# Altium project RK3328.PrjPcb (part 1 of 3)
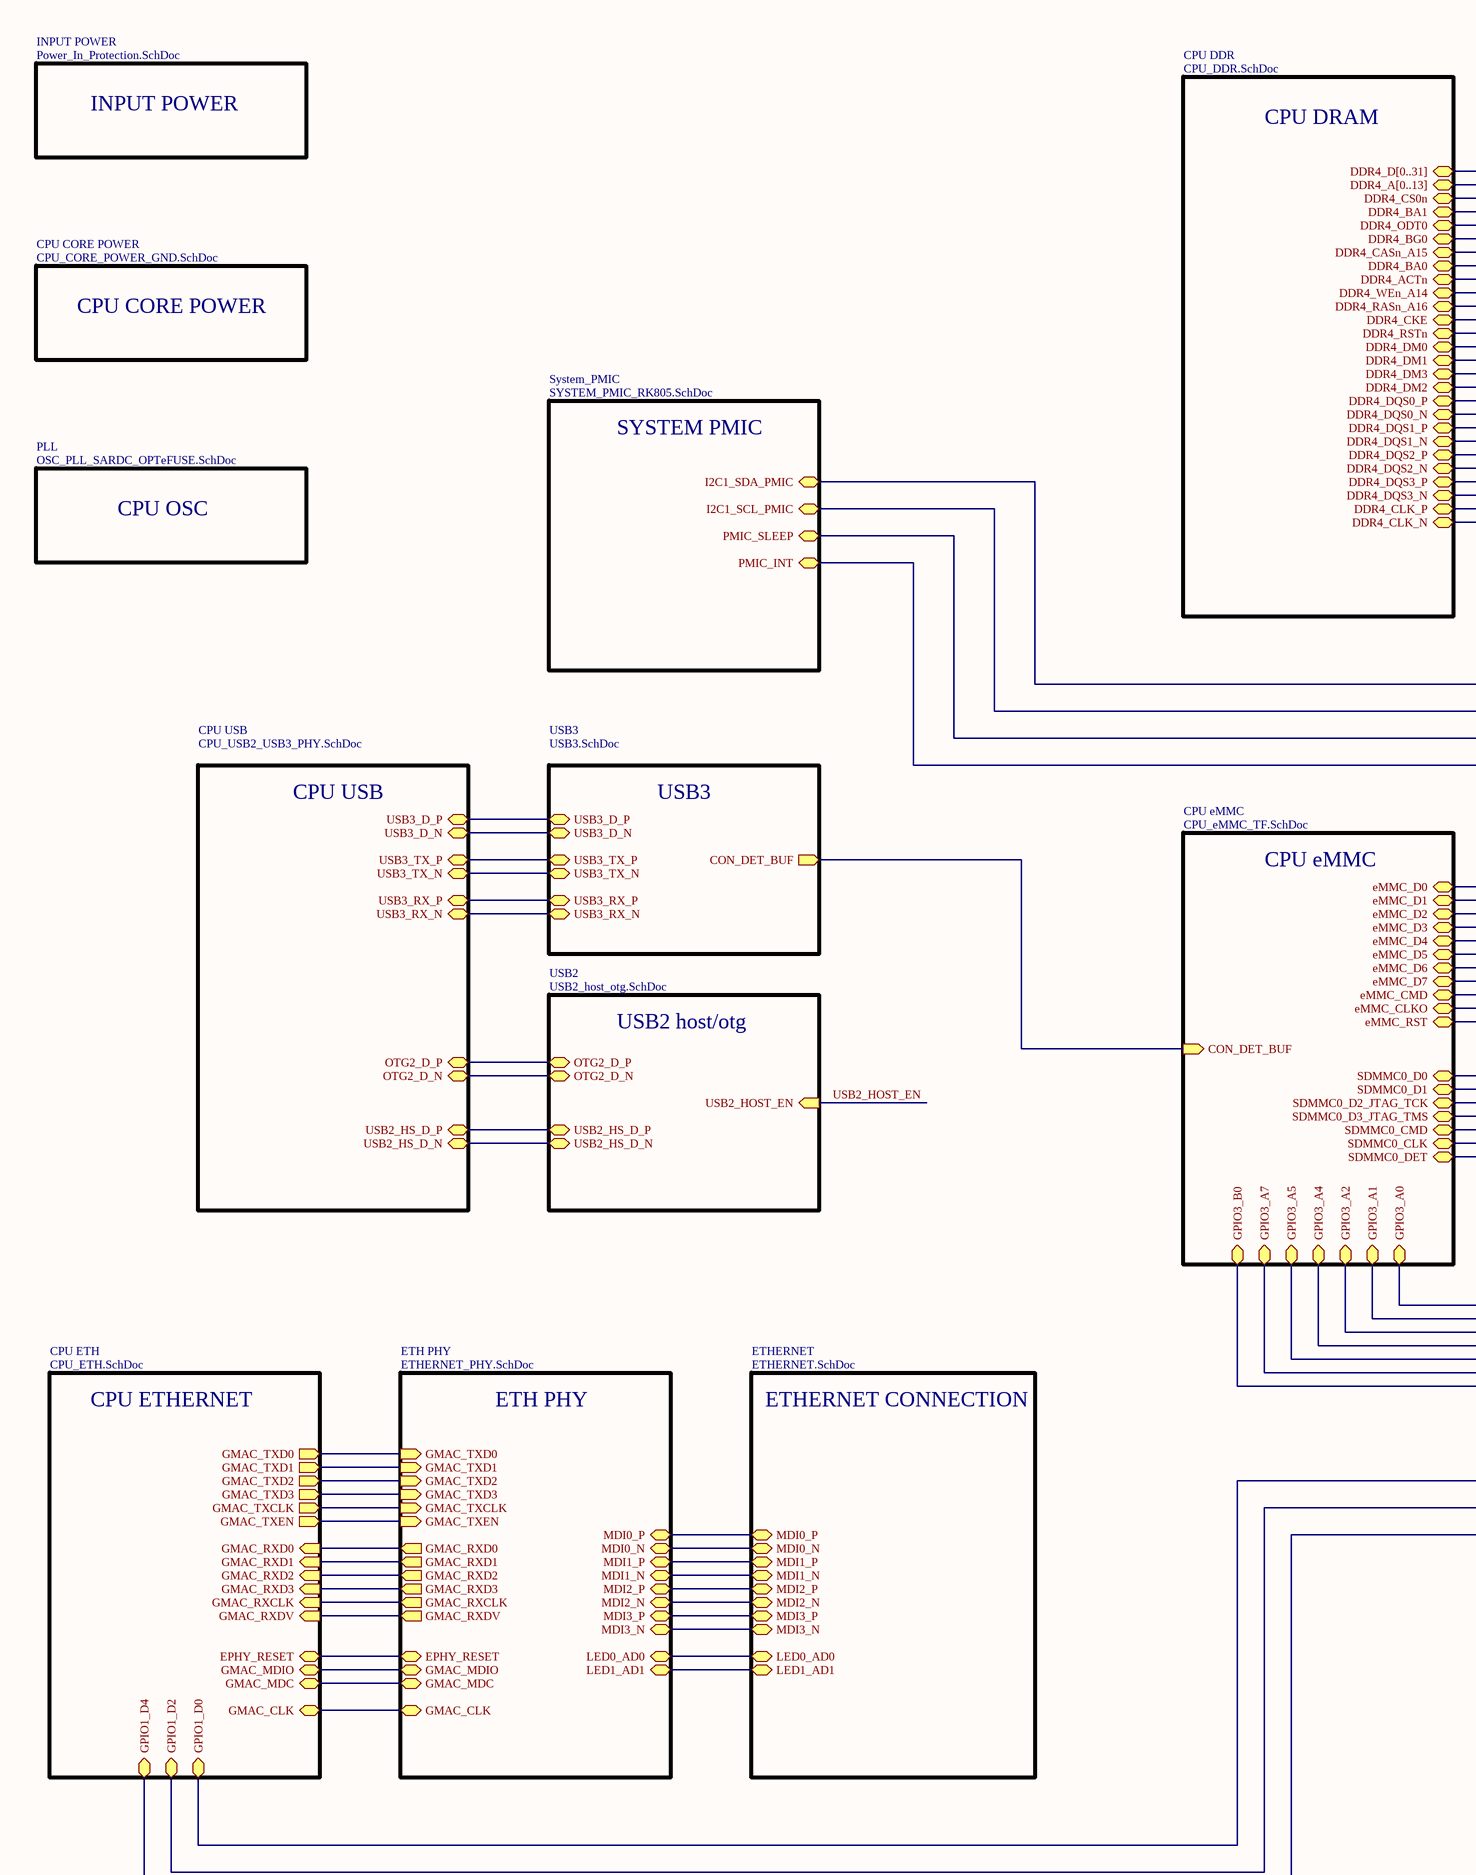
[diagram p0: BLOCKS.SchDoc, left]
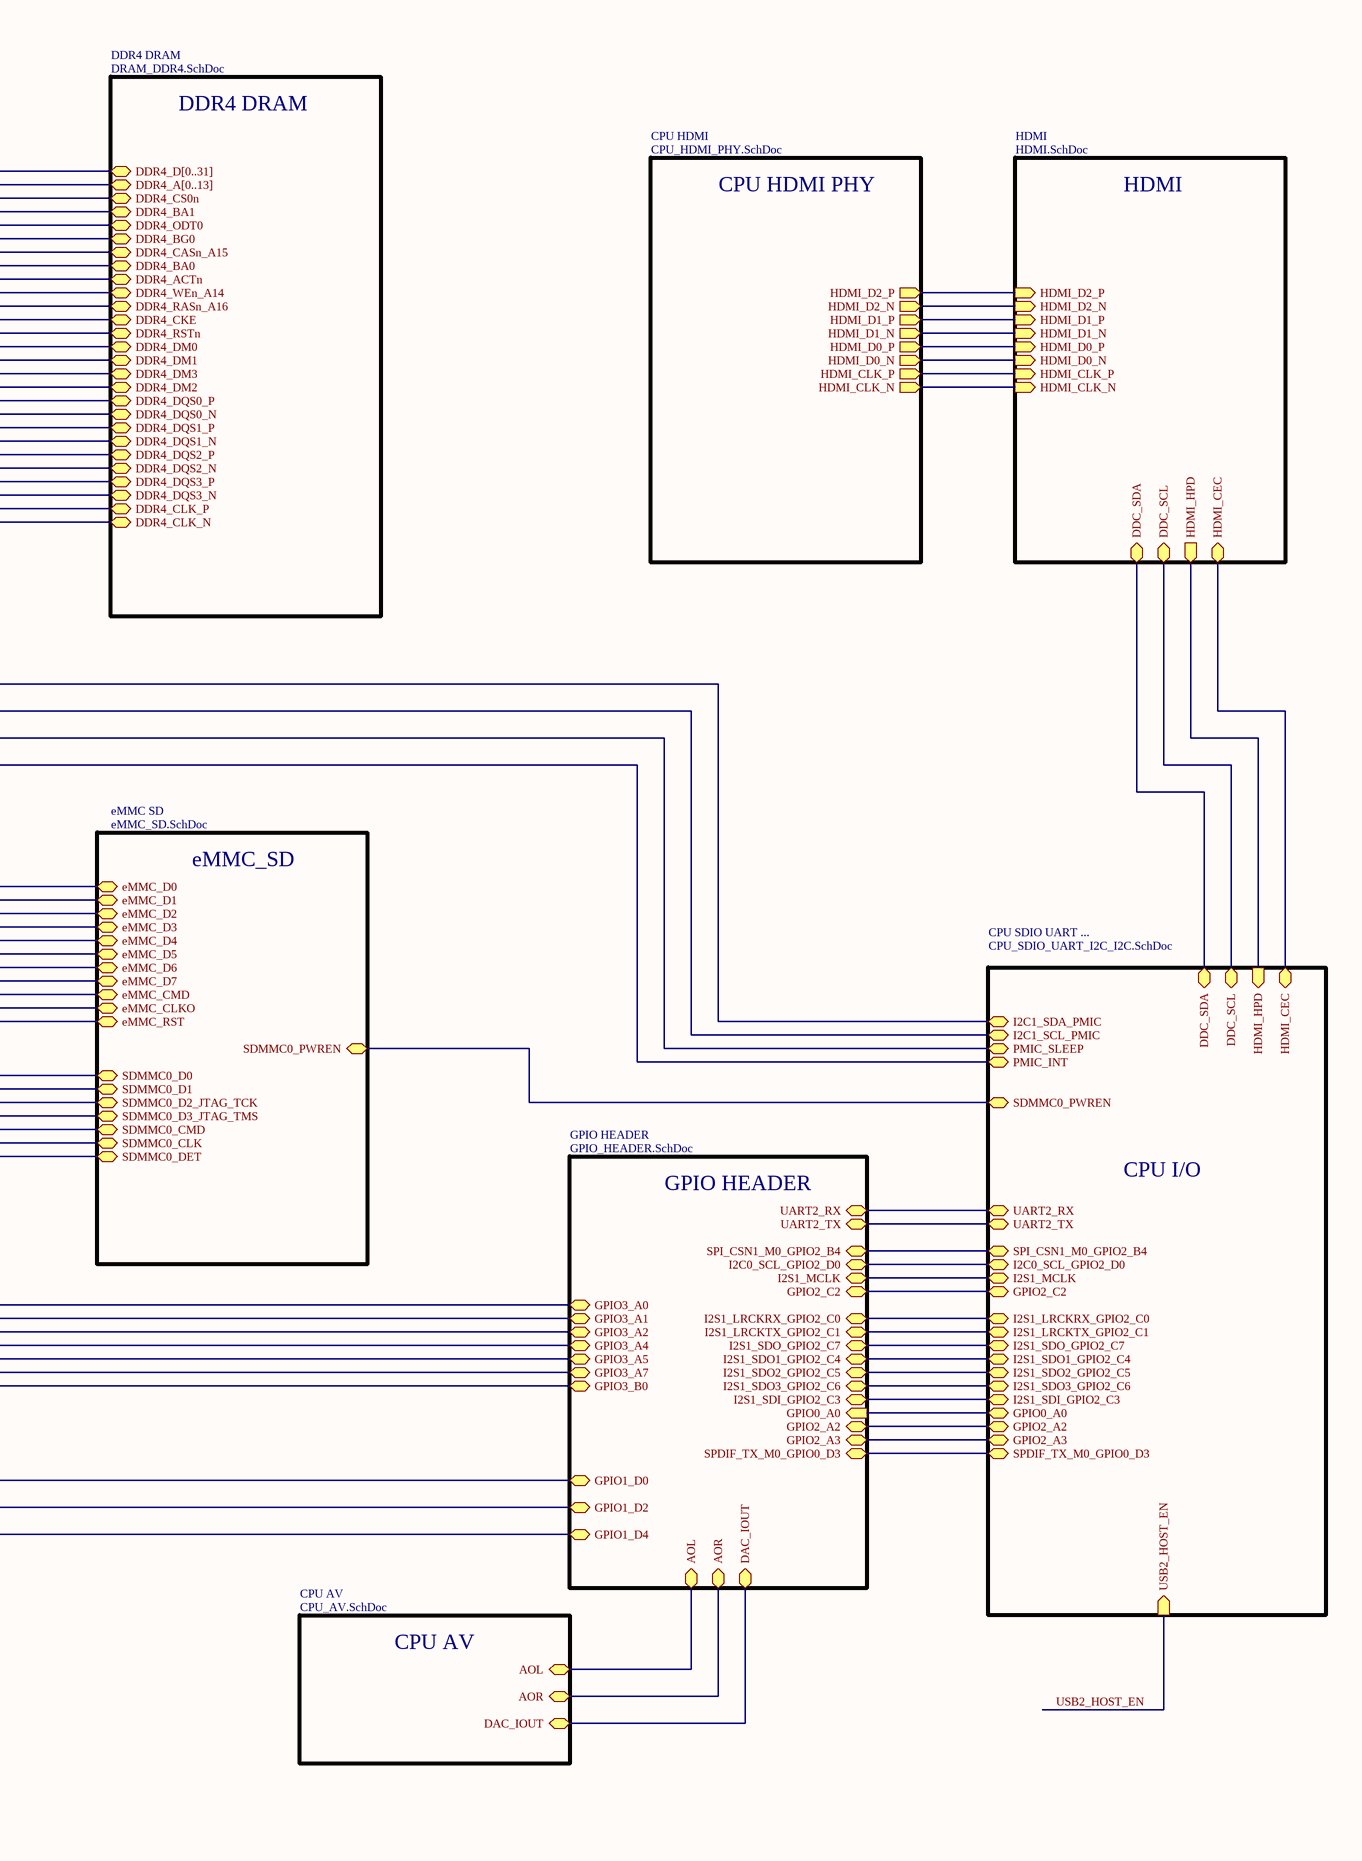
[diagram p1: BLOCKS.SchDoc, right]
21 sheets, 373 parts. Net scope: hierarchical (ports join the sheet entries above them; power ports are global).
Board file: RK3328.PcbDoc
Sheets:
  Cover.SchDoc
  BLOCKS.SchDoc
    System_PMIC = SYSTEM_PMIC_RK805.SchDoc
    CPU CORE POWER = CPU_CORE_POWER_GND.SchDoc
    CPU DDR = CPU_DDR.SchDoc
    DDR4 DRAM = DRAM_DDR4.SchDoc
    CPU eMMC = CPU_eMMC_TF.SchDoc
    eMMC SD = eMMC_SD.SchDoc
    PLL = OSC_PLL_SARDC_OPTeFUSE.SchDoc
    CPU USB = CPU_USB2_USB3_PHY.SchDoc
    USB3 = USB3.SchDoc
    USB2 = USB2_host_otg.SchDoc
    CPU HDMI = CPU_HDMI_PHY.SchDoc
    HDMI = HDMI.SchDoc
    CPU ETH = CPU_ETH.SchDoc
    ETH PHY = ETHERNET_PHY.SchDoc
    ETHERNET = ETHERNET.SchDoc
    GPIO HEADER = GPIO_HEADER.SchDoc
    CPU SDIO UART ... = CPU_SDIO_UART_I2C_I2C.SchDoc
    CPU AV = CPU_AV.SchDoc
    INPUT POWER = Power_In_Protection.SchDoc

## Sheet Cover.SchDoc
size A3; SheetNumber: 1; SheetTotal: 21

## Sheet BLOCKS.SchDoc
size A2; SheetNumber: 2; SheetTotal: 21

### Sub-sheets
CPU AV = CPU_AV.SchDoc: AOL (bidir), AOR (bidir), DAC_IOUT (bidir)
CPU CORE POWER = CPU_CORE_POWER_GND.SchDoc: no entries
CPU DDR = CPU_DDR.SchDoc: DDR4_D[0..31] (bidir), DDR4_A[0..13] (bidir), DDR4_CS0n (bidir), DDR4_BA1 (bidir), DDR4_ODT0 (bidir), DDR4_BG0 (bidir), DDR4_CASn_A15 (bidir), DDR4_BA0 (bidir), DDR4_ACTn (bidir), DDR4_WEn_A14 (bidir), DDR4_RASn_A16 (bidir), DDR4_CKE (bidir), DDR4_RSTn (bidir), DDR4_DM0 (bidir), DDR4_DM1 (bidir), DDR4_DM3 (bidir), DDR4_DM2 (bidir), DDR4_DQS0_P (bidir), DDR4_DQS0_N (bidir), DDR4_DQS1_P (bidir), DDR4_DQS1_N (bidir), DDR4_DQS2_P (bidir), DDR4_DQS2_N (bidir), DDR4_DQS3_P (bidir), DDR4_DQS3_N (bidir), DDR4_CLK_P (bidir), DDR4_CLK_N (bidir)
CPU eMMC = CPU_eMMC_TF.SchDoc: GPIO3_A4 (bidir), GPIO3_A5 (bidir), GPIO3_A7 (bidir), GPIO3_A0 (bidir), GPIO3_A2 (bidir), GPIO3_A1 (bidir), GPIO3_B0 (bidir), CON_DET_BUF (in), eMMC_D0 (bidir), eMMC_D1 (bidir), eMMC_D2 (bidir), eMMC_D3 (bidir), eMMC_D4 (bidir), eMMC_D5 (bidir), eMMC_D6 (bidir), eMMC_D7 (bidir), eMMC_CMD (bidir), eMMC_CLKO (bidir), eMMC_RST (bidir), SDMMC0_D0 (bidir), SDMMC0_D1 (bidir), SDMMC0_D2_JTAG_TCK (bidir), SDMMC0_D3_JTAG_TMS (bidir), SDMMC0_CMD (bidir), SDMMC0_CLK (bidir), SDMMC0_DET (bidir)
CPU ETH = CPU_ETH.SchDoc: GMAC_TXD1 (out), GMAC_TXD0 (out), GMAC_TXCLK (out), GMAC_TXD2 (out), GMAC_TXD3 (out), GMAC_TXEN (out), GMAC_RXD1 (in), GMAC_RXD0 (in), GMAC_RXD2 (in), GMAC_RXD3 (in), GMAC_RXCLK (in), GMAC_RXDV (in), GMAC_CLK (bidir), EPHY_RESET (bidir), GMAC_MDIO (bidir), GMAC_MDC (bidir), GPIO1_D2 (bidir), GPIO1_D4 (bidir), GPIO1_D0 (bidir)
CPU HDMI = CPU_HDMI_PHY.SchDoc: HDMI_D2_P (out), HDMI_D2_N (out), HDMI_D1_P (out), HDMI_D1_N (out), HDMI_D0_P (out), HDMI_D0_N (out), HDMI_CLK_P (out), HDMI_CLK_N (out)
CPU SDIO UART ... = CPU_SDIO_UART_I2C_I2C.SchDoc: HDMI_HPD (in), HDMI_CEC (bidir), DDC_SDA (bidir), I2C1_SDA_PMIC (bidir), I2C1_SCL_PMIC (bidir), PMIC_SLEEP (bidir), PMIC_INT (bidir), UART2_RX (bidir), UART2_TX (bidir), SPI_CSN1_M0_GPIO2_B4 (bidir), GPIO2_A3 (bidir), I2C0_SCL_GPIO2_D0 (bidir), I2S1_MCLK (bidir), GPIO2_C2 (bidir), I2S1_LRCKTX_GPIO2_C1 (bidir), I2S1_LRCKRX_GPIO2_C0 (bidir), I2S1_SDO_GPIO2_C7 (bidir), I2S1_SDO1_GPIO2_C4 (bidir), I2S1_SDO2_GPIO2_C5 (bidir), I2S1_SDO3_GPIO2_C6 (bidir), I2S1_SDI_GPIO2_C3 (bidir), USB2_HOST_EN (in), GPIO2_A2 (bidir), SPDIF_TX_M0_GPIO0_D3 (bidir), SDMMC0_PWREN (bidir), DDC_SCL (bidir), GPIO0_A0 (bidir)
CPU USB = CPU_USB2_USB3_PHY.SchDoc: USB3_D_P (bidir), USB3_D_N (bidir), USB3_RX_P (bidir), USB3_RX_N (bidir), USB3_TX_P (bidir), USB3_TX_N (bidir), OTG2_D_N (bidir), OTG2_D_P (bidir), USB2_HS_D_N (bidir), USB2_HS_D_P (bidir)
DDR4 DRAM = DRAM_DDR4.SchDoc: DDR4_D[0..31] (bidir), DDR4_A[0..13] (bidir), DDR4_CS0n (bidir), DDR4_BA1 (bidir), DDR4_ODT0 (bidir), DDR4_BG0 (bidir), DDR4_CASn_A15 (bidir), DDR4_BA0 (bidir), DDR4_ACTn (bidir), DDR4_WEn_A14 (bidir), DDR4_RASn_A16 (bidir), DDR4_CKE (bidir), DDR4_RSTn (bidir), DDR4_DM0 (bidir), DDR4_DM1 (bidir), DDR4_DM3 (bidir), DDR4_DM2 (bidir), DDR4_DQS0_P (bidir), DDR4_DQS0_N (bidir), DDR4_DQS1_P (bidir), DDR4_DQS1_N (bidir), DDR4_DQS2_P (bidir), DDR4_DQS2_N (bidir), DDR4_DQS3_P (bidir), DDR4_DQS3_N (bidir), DDR4_CLK_P (bidir), DDR4_CLK_N (bidir)
eMMC SD = eMMC_SD.SchDoc: eMMC_D1 (bidir), eMMC_D2 (bidir), eMMC_D3 (bidir), eMMC_D4 (bidir), eMMC_D5 (bidir), eMMC_D6 (bidir), eMMC_D7 (bidir), eMMC_D0 (bidir), eMMC_CLKO (bidir), eMMC_CMD (bidir), eMMC_RST (bidir), SDMMC0_PWREN (bidir), SDMMC0_D0 (bidir), SDMMC0_D1 (bidir), SDMMC0_D2_JTAG_TCK (bidir), SDMMC0_D3_JTAG_TMS (bidir), SDMMC0_CMD (bidir), SDMMC0_CLK (bidir), SDMMC0_DET (bidir)
ETH PHY = ETHERNET_PHY.SchDoc: GMAC_MDIO (bidir), GMAC_MDC (bidir), GMAC_RXD0 (out), GMAC_RXD1 (out), GMAC_RXD2 (out), GMAC_RXD3 (out), GMAC_RXCLK (out), GMAC_RXDV (out), GMAC_TXD0 (in), GMAC_TXD1 (in), GMAC_TXD2 (in), GMAC_TXD3 (in), GMAC_TXEN (in), GMAC_TXCLK (in), GMAC_CLK (bidir), EPHY_RESET (bidir), MDI0_P (bidir), MDI0_N (bidir), MDI1_P (bidir), MDI1_N (bidir), MDI2_P (bidir), MDI2_N (bidir), MDI3_P (bidir), MDI3_N (bidir), LED0_AD0 (bidir), LED1_AD1 (bidir)
ETHERNET = ETHERNET.SchDoc: MDI0_P (bidir), MDI0_N (bidir), MDI1_P (bidir), MDI1_N (bidir), MDI2_P (bidir), MDI2_N (bidir), MDI3_P (bidir), MDI3_N (bidir), LED0_AD0 (bidir), LED1_AD1 (bidir)
GPIO HEADER = GPIO_HEADER.SchDoc: AOL (bidir), AOR (bidir), GPIO3_A4 (bidir), GPIO3_A5 (bidir), GPIO3_A0 (bidir), GPIO3_A2 (bidir), GPIO3_A1 (bidir), GPIO3_B0 (bidir), GPIO1_D2 (bidir), GPIO3_A7 (bidir), GPIO1_D4 (bidir), DAC_IOUT (bidir), GPIO1_D0 (bidir), UART2_RX (bidir), UART2_TX (bidir), SPI_CSN1_M0_GPIO2_B4 (bidir), I2S1_LRCKRX_GPIO2_C0 (bidir), I2S1_SDO_GPIO2_C7 (bidir), I2S1_SDO1_GPIO2_C4 (bidir), I2S1_SDO2_GPIO2_C5 (bidir), I2S1_SDI_GPIO2_C3 (bidir), GPIO0_A0 (in), I2S1_MCLK (bidir), GPIO2_A2 (bidir), GPIO2_C2 (bidir), SPDIF_TX_M0_GPIO0_D3 (bidir), GPIO2_A3 (bidir), I2S1_LRCKTX_GPIO2_C1 (bidir), I2S1_SDO3_GPIO2_C6 (bidir), I2C0_SCL_GPIO2_D0 (bidir)
HDMI = HDMI.SchDoc: HDMI_D2_P (in), HDMI_D2_N (in), HDMI_D1_P (in), HDMI_D1_N (in), HDMI_D0_P (in), HDMI_D0_N (in), HDMI_CLK_P (in), HDMI_CLK_N (in), HDMI_CEC (bidir), DDC_SDA (bidir), HDMI_HPD (out), DDC_SCL (bidir)
INPUT POWER = Power_In_Protection.SchDoc: no entries
PLL = OSC_PLL_SARDC_OPTeFUSE.SchDoc: no entries
System_PMIC = SYSTEM_PMIC_RK805.SchDoc: I2C1_SCL_PMIC (bidir), I2C1_SDA_PMIC (bidir), PMIC_SLEEP (bidir), PMIC_INT (bidir)
USB2 = USB2_host_otg.SchDoc: USB2_HOST_EN (in), OTG2_D_P (bidir), OTG2_D_N (bidir), USB2_HS_D_P (bidir), USB2_HS_D_N (bidir)
USB3 = USB3.SchDoc: CON_DET_BUF (out), USB3_D_P (bidir), USB3_D_N (bidir), USB3_TX_P (bidir), USB3_TX_N (bidir), USB3_RX_P (bidir), USB3_RX_N (bidir)

### Nets
AOL: sheet GPIO HEADER/AOL, sheet CPU AV/AOL
AOR: sheet GPIO HEADER/AOR, sheet CPU AV/AOR
CON_DET_BUF: sheet CPU eMMC/CON_DET_BUF, sheet USB3/CON_DET_BUF
DAC_IOUT: sheet GPIO HEADER/DAC_IOUT, sheet CPU AV/DAC_IOUT
DDC_SCL: sheet HDMI/DDC_SCL, sheet CPU SDIO UART .../DDC_SCL
DDC_SDA: sheet HDMI/DDC_SDA, sheet CPU SDIO UART .../DDC_SDA
DDR4_ACTn: sheet CPU DDR/DDR4_ACTn, sheet DDR4 DRAM/DDR4_ACTn
DDR4_BA0: sheet CPU DDR/DDR4_BA0, sheet DDR4 DRAM/DDR4_BA0
DDR4_BA1: sheet CPU DDR/DDR4_BA1, sheet DDR4 DRAM/DDR4_BA1
DDR4_BG0: sheet CPU DDR/DDR4_BG0, sheet DDR4 DRAM/DDR4_BG0
DDR4_CASn_A15: sheet CPU DDR/DDR4_CASn_A15, sheet DDR4 DRAM/DDR4_CASn_A15
DDR4_CKE: sheet CPU DDR/DDR4_CKE, sheet DDR4 DRAM/DDR4_CKE
DDR4_CLK_N: sheet CPU DDR/DDR4_CLK_N, sheet DDR4 DRAM/DDR4_CLK_N
DDR4_CLK_P: sheet CPU DDR/DDR4_CLK_P, sheet DDR4 DRAM/DDR4_CLK_P
DDR4_CS0n: sheet CPU DDR/DDR4_CS0n, sheet DDR4 DRAM/DDR4_CS0n
DDR4_DM0: sheet CPU DDR/DDR4_DM0, sheet DDR4 DRAM/DDR4_DM0
DDR4_DM1: sheet CPU DDR/DDR4_DM1, sheet DDR4 DRAM/DDR4_DM1
DDR4_DM2: sheet CPU DDR/DDR4_DM2, sheet DDR4 DRAM/DDR4_DM2
DDR4_DM3: sheet CPU DDR/DDR4_DM3, sheet DDR4 DRAM/DDR4_DM3
DDR4_DQS0_N: sheet CPU DDR/DDR4_DQS0_N, sheet DDR4 DRAM/DDR4_DQS0_N
DDR4_DQS0_P: sheet CPU DDR/DDR4_DQS0_P, sheet DDR4 DRAM/DDR4_DQS0_P
DDR4_DQS1_N: sheet CPU DDR/DDR4_DQS1_N, sheet DDR4 DRAM/DDR4_DQS1_N
DDR4_DQS1_P: sheet CPU DDR/DDR4_DQS1_P, sheet DDR4 DRAM/DDR4_DQS1_P
DDR4_DQS2_N: sheet CPU DDR/DDR4_DQS2_N, sheet DDR4 DRAM/DDR4_DQS2_N
DDR4_DQS2_P: sheet CPU DDR/DDR4_DQS2_P, sheet DDR4 DRAM/DDR4_DQS2_P
DDR4_DQS3_N: sheet CPU DDR/DDR4_DQS3_N, sheet DDR4 DRAM/DDR4_DQS3_N
DDR4_DQS3_P: sheet CPU DDR/DDR4_DQS3_P, sheet DDR4 DRAM/DDR4_DQS3_P
DDR4_ODT0: sheet CPU DDR/DDR4_ODT0, sheet DDR4 DRAM/DDR4_ODT0
DDR4_RASn_A16: sheet CPU DDR/DDR4_RASn_A16, sheet DDR4 DRAM/DDR4_RASn_A16
DDR4_RSTn: sheet CPU DDR/DDR4_RSTn, sheet DDR4 DRAM/DDR4_RSTn
DDR4_WEn_A14: sheet CPU DDR/DDR4_WEn_A14, sheet DDR4 DRAM/DDR4_WEn_A14
eMMC_CLKO: sheet CPU eMMC/eMMC_CLKO, sheet eMMC SD/eMMC_CLKO
eMMC_CMD: sheet CPU eMMC/eMMC_CMD, sheet eMMC SD/eMMC_CMD
eMMC_D0: sheet CPU eMMC/eMMC_D0, sheet eMMC SD/eMMC_D0
eMMC_D1: sheet CPU eMMC/eMMC_D1, sheet eMMC SD/eMMC_D1
eMMC_D2: sheet CPU eMMC/eMMC_D2, sheet eMMC SD/eMMC_D2
eMMC_D3: sheet CPU eMMC/eMMC_D3, sheet eMMC SD/eMMC_D3
eMMC_D4: sheet CPU eMMC/eMMC_D4, sheet eMMC SD/eMMC_D4
eMMC_D5: sheet CPU eMMC/eMMC_D5, sheet eMMC SD/eMMC_D5
eMMC_D6: sheet CPU eMMC/eMMC_D6, sheet eMMC SD/eMMC_D6
eMMC_D7: sheet CPU eMMC/eMMC_D7, sheet eMMC SD/eMMC_D7
eMMC_RST: sheet CPU eMMC/eMMC_RST, sheet eMMC SD/eMMC_RST
EPHY_RESET: sheet CPU ETH/EPHY_RESET, sheet ETH PHY/EPHY_RESET
GMAC_CLK: sheet CPU ETH/GMAC_CLK, sheet ETH PHY/GMAC_CLK
GMAC_MDC: sheet CPU ETH/GMAC_MDC, sheet ETH PHY/GMAC_MDC
GMAC_MDIO: sheet CPU ETH/GMAC_MDIO, sheet ETH PHY/GMAC_MDIO
GMAC_RXCLK: sheet CPU ETH/GMAC_RXCLK, sheet ETH PHY/GMAC_RXCLK
GMAC_RXD0: sheet CPU ETH/GMAC_RXD0, sheet ETH PHY/GMAC_RXD0
GMAC_RXD1: sheet CPU ETH/GMAC_RXD1, sheet ETH PHY/GMAC_RXD1
GMAC_RXD2: sheet CPU ETH/GMAC_RXD2, sheet ETH PHY/GMAC_RXD2
GMAC_RXD3: sheet CPU ETH/GMAC_RXD3, sheet ETH PHY/GMAC_RXD3
GMAC_RXDV: sheet CPU ETH/GMAC_RXDV, sheet ETH PHY/GMAC_RXDV
GMAC_TXCLK: sheet CPU ETH/GMAC_TXCLK, sheet ETH PHY/GMAC_TXCLK
GMAC_TXD0: sheet CPU ETH/GMAC_TXD0, sheet ETH PHY/GMAC_TXD0
GMAC_TXD1: sheet CPU ETH/GMAC_TXD1, sheet ETH PHY/GMAC_TXD1
GMAC_TXD2: sheet CPU ETH/GMAC_TXD2, sheet ETH PHY/GMAC_TXD2
GMAC_TXD3: sheet CPU ETH/GMAC_TXD3, sheet ETH PHY/GMAC_TXD3
GMAC_TXEN: sheet CPU ETH/GMAC_TXEN, sheet ETH PHY/GMAC_TXEN
GPIO0_A0: sheet GPIO HEADER/GPIO0_A0, sheet CPU SDIO UART .../GPIO0_A0
GPIO1_D0: sheet CPU ETH/GPIO1_D0, sheet GPIO HEADER/GPIO1_D0
GPIO1_D2: sheet CPU ETH/GPIO1_D2, sheet GPIO HEADER/GPIO1_D2
GPIO1_D4: sheet CPU ETH/GPIO1_D4, sheet GPIO HEADER/GPIO1_D4
GPIO2_A2: sheet GPIO HEADER/GPIO2_A2, sheet CPU SDIO UART .../GPIO2_A2
GPIO2_A3: sheet GPIO HEADER/GPIO2_A3, sheet CPU SDIO UART .../GPIO2_A3
GPIO2_C2: sheet GPIO HEADER/GPIO2_C2, sheet CPU SDIO UART .../GPIO2_C2
GPIO3_A0: sheet CPU eMMC/GPIO3_A0, sheet GPIO HEADER/GPIO3_A0
GPIO3_A1: sheet CPU eMMC/GPIO3_A1, sheet GPIO HEADER/GPIO3_A1
GPIO3_A2: sheet CPU eMMC/GPIO3_A2, sheet GPIO HEADER/GPIO3_A2
GPIO3_A4: sheet CPU eMMC/GPIO3_A4, sheet GPIO HEADER/GPIO3_A4
GPIO3_A5: sheet CPU eMMC/GPIO3_A5, sheet GPIO HEADER/GPIO3_A5
GPIO3_A7: sheet CPU eMMC/GPIO3_A7, sheet GPIO HEADER/GPIO3_A7
GPIO3_B0: sheet CPU eMMC/GPIO3_B0, sheet GPIO HEADER/GPIO3_B0
HDMI_CEC: sheet HDMI/HDMI_CEC, sheet CPU SDIO UART .../HDMI_CEC
HDMI_CLK_N: sheet CPU HDMI/HDMI_CLK_N, sheet HDMI/HDMI_CLK_N
HDMI_CLK_P: sheet CPU HDMI/HDMI_CLK_P, sheet HDMI/HDMI_CLK_P
HDMI_D0_N: sheet CPU HDMI/HDMI_D0_N, sheet HDMI/HDMI_D0_N
HDMI_D0_P: sheet CPU HDMI/HDMI_D0_P, sheet HDMI/HDMI_D0_P
HDMI_D1_N: sheet CPU HDMI/HDMI_D1_N, sheet HDMI/HDMI_D1_N
HDMI_D1_P: sheet CPU HDMI/HDMI_D1_P, sheet HDMI/HDMI_D1_P
HDMI_D2_N: sheet CPU HDMI/HDMI_D2_N, sheet HDMI/HDMI_D2_N
HDMI_D2_P: sheet CPU HDMI/HDMI_D2_P, sheet HDMI/HDMI_D2_P
HDMI_HPD: sheet HDMI/HDMI_HPD, sheet CPU SDIO UART .../HDMI_HPD
I2C0_SCL_GPIO2_D0: sheet GPIO HEADER/I2C0_SCL_GPIO2_D0, sheet CPU SDIO UART .../I2C0_SCL_GPIO2_D0
I2C1_SCL_PMIC: sheet System_PMIC/I2C1_SCL_PMIC, sheet CPU SDIO UART .../I2C1_SCL_PMIC
I2C1_SDA_PMIC: sheet System_PMIC/I2C1_SDA_PMIC, sheet CPU SDIO UART .../I2C1_SDA_PMIC
I2S1_LRCKRX_GPIO2_C0: sheet GPIO HEADER/I2S1_LRCKRX_GPIO2_C0, sheet CPU SDIO UART .../I2S1_LRCKRX_GPIO2_C0
I2S1_LRCKTX_GPIO2_C1: sheet GPIO HEADER/I2S1_LRCKTX_GPIO2_C1, sheet CPU SDIO UART .../I2S1_LRCKTX_GPIO2_C1
I2S1_MCLK: sheet GPIO HEADER/I2S1_MCLK, sheet CPU SDIO UART .../I2S1_MCLK
I2S1_SDI_GPIO2_C3: sheet GPIO HEADER/I2S1_SDI_GPIO2_C3, sheet CPU SDIO UART .../I2S1_SDI_GPIO2_C3
I2S1_SDO1_GPIO2_C4: sheet GPIO HEADER/I2S1_SDO1_GPIO2_C4, sheet CPU SDIO UART .../I2S1_SDO1_GPIO2_C4
I2S1_SDO2_GPIO2_C5: sheet GPIO HEADER/I2S1_SDO2_GPIO2_C5, sheet CPU SDIO UART .../I2S1_SDO2_GPIO2_C5
I2S1_SDO3_GPIO2_C6: sheet GPIO HEADER/I2S1_SDO3_GPIO2_C6, sheet CPU SDIO UART .../I2S1_SDO3_GPIO2_C6
I2S1_SDO_GPIO2_C7: sheet GPIO HEADER/I2S1_SDO_GPIO2_C7, sheet CPU SDIO UART .../I2S1_SDO_GPIO2_C7
LED0_AD0: sheet ETH PHY/LED0_AD0, sheet ETHERNET/LED0_AD0
LED1_AD1: sheet ETH PHY/LED1_AD1, sheet ETHERNET/LED1_AD1
MDI0_N: sheet ETH PHY/MDI0_N, sheet ETHERNET/MDI0_N
MDI0_P: sheet ETH PHY/MDI0_P, sheet ETHERNET/MDI0_P
MDI1_N: sheet ETH PHY/MDI1_N, sheet ETHERNET/MDI1_N
MDI1_P: sheet ETH PHY/MDI1_P, sheet ETHERNET/MDI1_P
MDI2_N: sheet ETH PHY/MDI2_N, sheet ETHERNET/MDI2_N
MDI2_P: sheet ETH PHY/MDI2_P, sheet ETHERNET/MDI2_P
MDI3_N: sheet ETH PHY/MDI3_N, sheet ETHERNET/MDI3_N
MDI3_P: sheet ETH PHY/MDI3_P, sheet ETHERNET/MDI3_P
OTG2_D_N: sheet CPU USB/OTG2_D_N, sheet USB2/OTG2_D_N
OTG2_D_P: sheet CPU USB/OTG2_D_P, sheet USB2/OTG2_D_P
PMIC_INT: sheet System_PMIC/PMIC_INT, sheet CPU SDIO UART .../PMIC_INT
PMIC_SLEEP: sheet System_PMIC/PMIC_SLEEP, sheet CPU SDIO UART .../PMIC_SLEEP
SDMMC0_CLK: sheet CPU eMMC/SDMMC0_CLK, sheet eMMC SD/SDMMC0_CLK
SDMMC0_CMD: sheet CPU eMMC/SDMMC0_CMD, sheet eMMC SD/SDMMC0_CMD
SDMMC0_D0: sheet CPU eMMC/SDMMC0_D0, sheet eMMC SD/SDMMC0_D0
SDMMC0_D1: sheet CPU eMMC/SDMMC0_D1, sheet eMMC SD/SDMMC0_D1
SDMMC0_D2_JTAG_TCK: sheet CPU eMMC/SDMMC0_D2_JTAG_TCK, sheet eMMC SD/SDMMC0_D2_JTAG_TCK
SDMMC0_D3_JTAG_TMS: sheet CPU eMMC/SDMMC0_D3_JTAG_TMS, sheet eMMC SD/SDMMC0_D3_JTAG_TMS
SDMMC0_DET: sheet CPU eMMC/SDMMC0_DET, sheet eMMC SD/SDMMC0_DET
SDMMC0_PWREN: sheet eMMC SD/SDMMC0_PWREN, sheet CPU SDIO UART .../SDMMC0_PWREN
SPDIF_TX_M0_GPIO0_D3: sheet GPIO HEADER/SPDIF_TX_M0_GPIO0_D3, sheet CPU SDIO UART .../SPDIF_TX_M0_GPIO0_D3
SPI_CSN1_M0_GPIO2_B4: sheet GPIO HEADER/SPI_CSN1_M0_GPIO2_B4, sheet CPU SDIO UART .../SPI_CSN1_M0_GPIO2_B4
UART2_RX: sheet GPIO HEADER/UART2_RX, sheet CPU SDIO UART .../UART2_RX
UART2_TX: sheet GPIO HEADER/UART2_TX, sheet CPU SDIO UART .../UART2_TX
USB2_HOST_EN: sheet USB2/USB2_HOST_EN, sheet CPU SDIO UART .../USB2_HOST_EN
USB2_HS_D_N: sheet CPU USB/USB2_HS_D_N, sheet USB2/USB2_HS_D_N
USB2_HS_D_P: sheet CPU USB/USB2_HS_D_P, sheet USB2/USB2_HS_D_P
USB3_D_N: sheet CPU USB/USB3_D_N, sheet USB3/USB3_D_N
USB3_D_P: sheet CPU USB/USB3_D_P, sheet USB3/USB3_D_P
USB3_RX_N: sheet CPU USB/USB3_RX_N, sheet USB3/USB3_RX_N
USB3_RX_P: sheet CPU USB/USB3_RX_P, sheet USB3/USB3_RX_P
USB3_TX_N: sheet CPU USB/USB3_TX_N, sheet USB3/USB3_TX_N
USB3_TX_P: sheet CPU USB/USB3_TX_P, sheet USB3/USB3_TX_P

### Buses and harness runs
bus sheet CPU DDR/DDR4_A[0..13] = sheet DDR4 DRAM/DDR4_A[0..13]
bus sheet CPU DDR/DDR4_D[0..31] = sheet DDR4 DRAM/DDR4_D[0..31]

### Notes on the sheet
- INPUT POWER
- DDR4 DRAM
- CPU DRAM
- CPU HDMI PHY
- HDMI
- CPU CORE POWER
- SYSTEM PMIC
- CPU OSC
- CPU USB
- USB3
- CPU eMMC
- eMMC_SD
- USB2 host/otg
- GPIO HEADER
- CPU I/O
- CPU ETHERNET
- ETH PHY
- ETHERNET CONNECTION
- CPU AV

## Sheet SYSTEM_PMIC_RK805.SchDoc
size A3; SheetNumber: 4; SheetTotal: 21
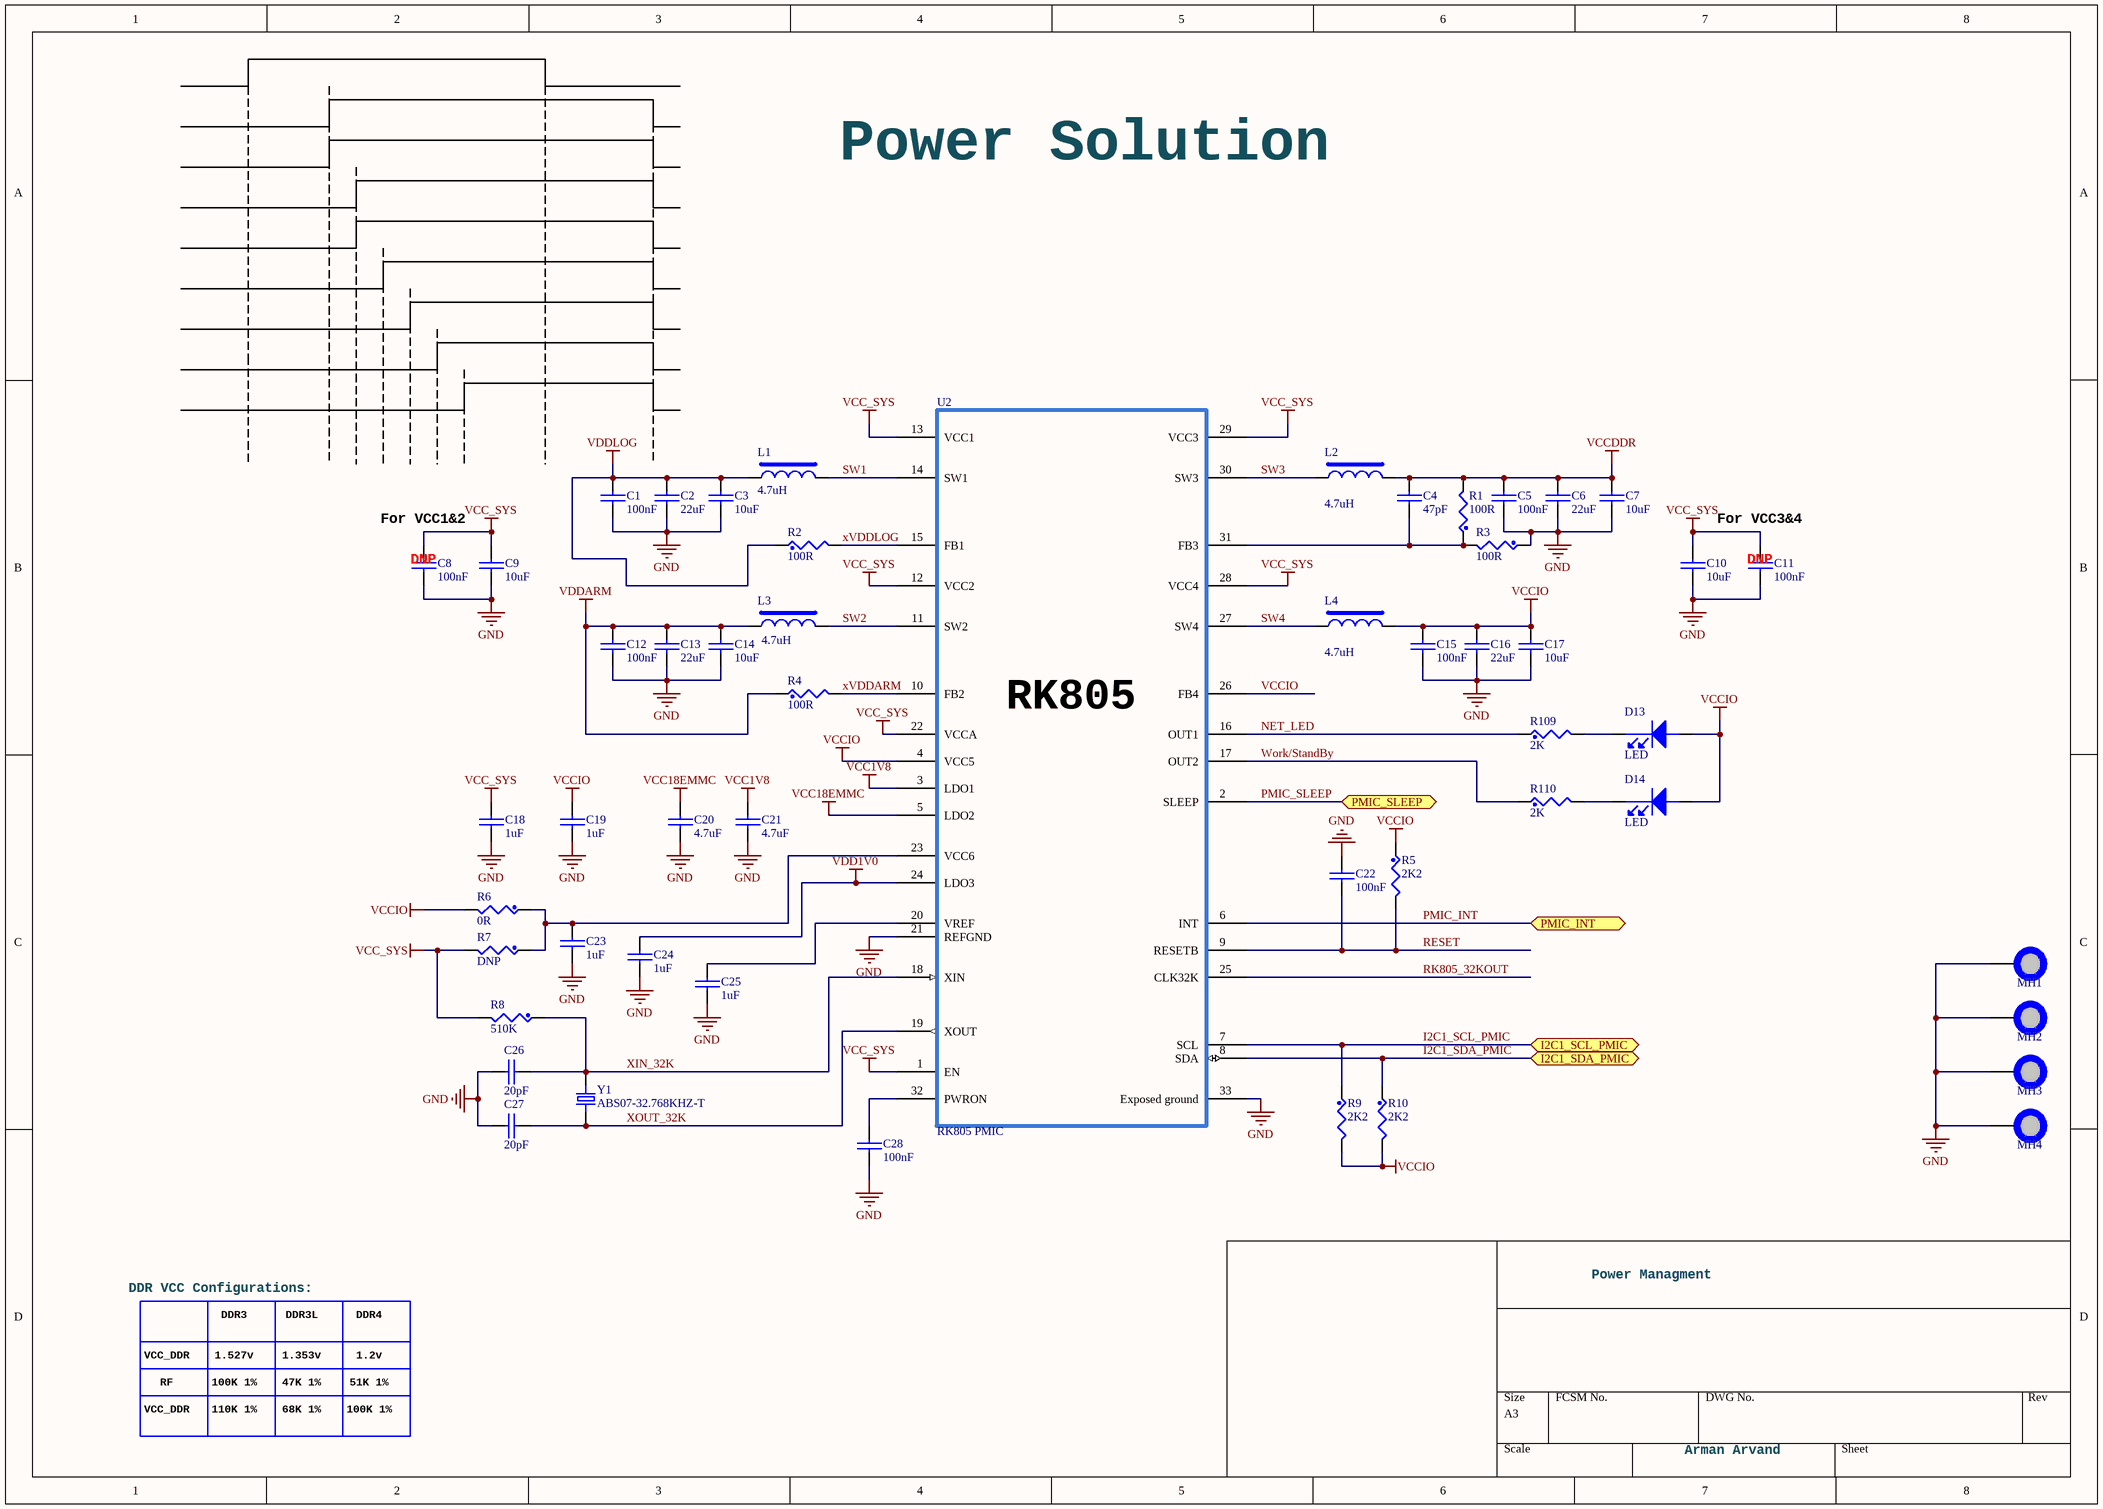
[diagram p2: SYSTEM_PMIC_RK805.SchDoc]

### Parts
C1  100nF  [0402_CC - C]
C2  22uF  [0603_CC]
C3  10uF  [0603_CC]
C4  47pF  [0402_CC - C]
C5  100nF  [0402_CC - C]
C6  22uF  [0603_CC]
C7  10uF  [0603_CC]
C8  100nF  [0402_CC - C]
C9  10uF  [0805_CC]
C10  10uF  [0805_CC]
C11  100nF  [0402_CC - C]
C12  100nF  [0402_CC - C]
C13  22uF  [0603_CC]
C14  10uF  [0603_CC]
C15  100nF  [0402_CC - C]
C16  22uF  [0603_CC]
C17  10uF  [0603_CC]
C18  1uF  [0402_CC - C]
C19  1uF  [0402_CC - C]
C20  4.7uF  [0603_CC]
C21  4.7uF  [0603_CC]
C22  100nF  [0402_CC - C]
C23  1uF  [0402_CC - C]
C24  1uF  [0402_CC - C]
C25  1uF  [0402_CC - C]
C26  20pF  [0402_CC - C]
C27  20pF  [0402_CC - C]
C28  100nF  [0402_CC - C]
D13  LED  [LED_0603]
D14  LED  [LED_0603]
L1  value 4.7uH  [INDC3020X12N]  (hidden comment: Fixed Inductors 4.7uH 20% 200mOhm 1.9A)
L2  value 4.7uH  [INDC3020X12N]  (hidden comment: Fixed Inductors 4.7uH 20% 200mOhm 1.9A)
L3  value 4.7uH  [INDC3020X12N]  (hidden comment: Fixed Inductors 4.7uH 20% 200mOhm 1.9A)
L4  value 4.7uH  [INDC3020X12N]  (hidden comment: Fixed Inductors 4.7uH 20% 200mOhm 1.9A)
MH1  MH_5MMC_2.2MMD  [MH_5MMD_2.2MMD]  (value not drawn)  (no BOM)
MH2  MH_5MMC_2.2MMD  [MH_5MMD_2.2MMD]  (value not drawn)  (no BOM)
MH3  MH_5MMC_2.2MMD  [MH_5MMD_2.2MMD]  (value not drawn)  (no BOM)
MH4  MH_5MMC_2.2MMD  [MH_5MMD_2.2MMD]  (value not drawn)  (no BOM)
R1  100R  [0402_CR]
R2  100R  [0402_CR]
R3  100R  [0402_CR]
R4  100R  [0402_CR]
R5  2K2  [0402_CR]
R6  0R  [0402_CR]
R7  DNP  [0402_CR]
R8  510K  [0402_CR]
R9  2K2  [0402_CR]
R10  2K2  [0402_CR]
R109  2K  [0402_CR]
R110  2K  [0402_CR]
U2  RK805 PMIC  [QFN40P400X400X80_HS-33N]
Y1  ABS07-32.768KHZ-T  [XTAL_ABS07-32.768KHZ-T]

### Ports
I2C1_SCL_PMIC (bidir), I2C1_SDA_PMIC (bidir), PMIC_INT (bidir), PMIC_SLEEP (bidir)

### Nets
GND: C1.2 C2.2 C3.2 C5.2 C6.2 C7.2 C8.2 C9.2 C10.2 C11.2 C12.2 C13.2 C14.2 C15.2 C16.2 C17.2 C18.2 C19.2 C20.2 C21.2 C22.2 C23.2 C24.2 C25.2 C26.1 C27.1 C28.1 MH1.1 MH2.1 MH3.1 MH4.1 R3.1 U2.21(REFGND) U2.33(Exposed_ground)
VCC1V8: C21.1 U2.3(LDO1)
VCC18EMMC: C20.1 U2.5(LDO2)
VCC_SYS: C8.1 C9.1 C10.1 C11.1 C18.1 R7.2 R8.2 U2.1(EN) U2.12(VCC2) U2.13(VCC1) U2.22(VCCA) U2.28(VCC4) U2.29(VCC3)
VCCDDR: C4.1 C5.1 C6.1 C7.1 L2.2 R1.2
VCCIO: C15.1 C16.1 C17.1 C19.1 D13.A(ANODE) D14.A(ANODE) L4.2 R5.1 R6.2 R9.2 R10.2 U2.4(VCC5) U2.26(FB4)
VDD1V0: C24.1 U2.24(LDO3)
VDDARM: C12.1 C13.1 C14.1 L3.1 R4.1
VDDLOG: C1.1 C2.1 C3.1 L1.1 R2.1
I2C1_SCL_PMIC: R9.1 U2.7(SCL) ; port I2C1_SCL_PMIC
I2C1_SDA_PMIC: R10.1 U2.8(SDA) ; port I2C1_SDA_PMIC
NET_LED: R109.1 U2.16(OUT1)
PMIC_INT: U2.6(INT) ; port PMIC_INT
PMIC_SLEEP: U2.2(SLEEP) ; port PMIC_SLEEP
RESET: C22.1 R5.2 U2.9(RESETB)
RK805_32KOUT: U2.25(CLK32K)
SW1: L1.2 U2.14(SW1)
SW2: L3.2 U2.11(SW2)
SW3: L2.1 U2.30(SW3)
SW4: L4.1 U2.27(SW4)
Work/StandBy: R110.1 U2.17(OUT2)
XIN_32K: C26.2 R8.1 U2.18(XIN) Y1.2
XOUT_32K: C27.2 U2.19(XOUT) Y1.1
xVDDARM: R4.2 U2.10(FB2)
xVDDLOG: R2.2 U2.15(FB1)
NetC4_2: C4.2 R1.1 R3.2 U2.31(FB3)
NetC23_1: C23.1 R6.1 R7.1 U2.23(VCC6)
NetC25_1: C25.1 U2.20(VREF)
NetC28_2: C28.2 U2.32(PWRON)
NetD13_C: D13.C(CATHODE) R109.2
NetD14_C: D14.C(CATHODE) R110.2

### Notes on the sheet
- Power Solution
- For VCC1&2
- For VCC3&4
- (near C8) DNP
- (near C11) DNP
- DDR VCC Configurations:
- DDR3
- DDR3L
- DDR4
- Power Managment
- VCC_DDR
- RF
- 1.527v
- 100K 1%
- 1.353v
- 47K 1%
- 1.2v
- 51K 1%
- 110K 1%
- 68K 1%
- Arman Arvand

### Library data of the parts
C1-C28 = CAP_NP: CLASS: DISCRETE
D13 D14 = LED: CLASS: IC
L1-L4 = TMS252012ALM-4R7MTAA: Fixed Inductors 4.7uH 20% 200mOhm 1.9A, From TDK, / Lis: AAR; Type: Thin Film; Maximum DC Current: 1.6 A; Maximum DC Resistance:: 200 mOhms; ComponentLink1Description: Mouser; ComponentLink1URL: https://www.mouser.com/ProductDetail/TDK/TMS252012ALM-4R7MTAA?qs=7MVldsJ5UazqXFKTXswO8w%3D%3D; Mfr_Part_No: TMS252012ALM-4R7MTAA; Mouser No: 810-TMS252012ALM4R7M; Mfr: TDK; Package/Case: 1008 (2520 metric); Length: 2.5 mm; Width: 2 mm; Case Code - in: 1008; Case Code - mm: 2520; Supplier 1: Digi-Key; Supplier 2: Digi-Key; Supplier 3: Digi-Key; Supplier 4: Mouser; Supplier Part Number 1: 445-TMS252012ALM-4R7MTAACT-ND; Supplier Part Number 2: 445-TMS252012ALM-4R7MTAADKR-ND; Supplier Part Number 3: 445-TMS252012ALM-4R7MTAATR-ND; Supplier Part Number 4: 810-TMS252012ALM4R7M
MH1-MH4 = MH_5MMC_2.2MMD: Mounting Hole 5mm Diameter, 2.2mm Drill
R1-R10 R109 R110 = RES: CLASS: DISCRETE
U2 = RK805: RK805 PMIC, AAR
Y1 = ABS07-32.768KHZ-T: 32.768kHz Â±20ppm Crystal 12.5pF 70 kOhms 2-SMD, No Lead; Mfr: Abracon LLC; Mfr_Part_No: ABS07-32.768KHZ-4-T; Price: None; Value: *; Package: SMD-2 Abracon; Availability: Unavailable; Mouser No: 815-ABS07-32.7K-4-T

## Sheet CPU_CORE_POWER_GND.SchDoc
size A3; SheetNumber: 5; SheetTotal: 18
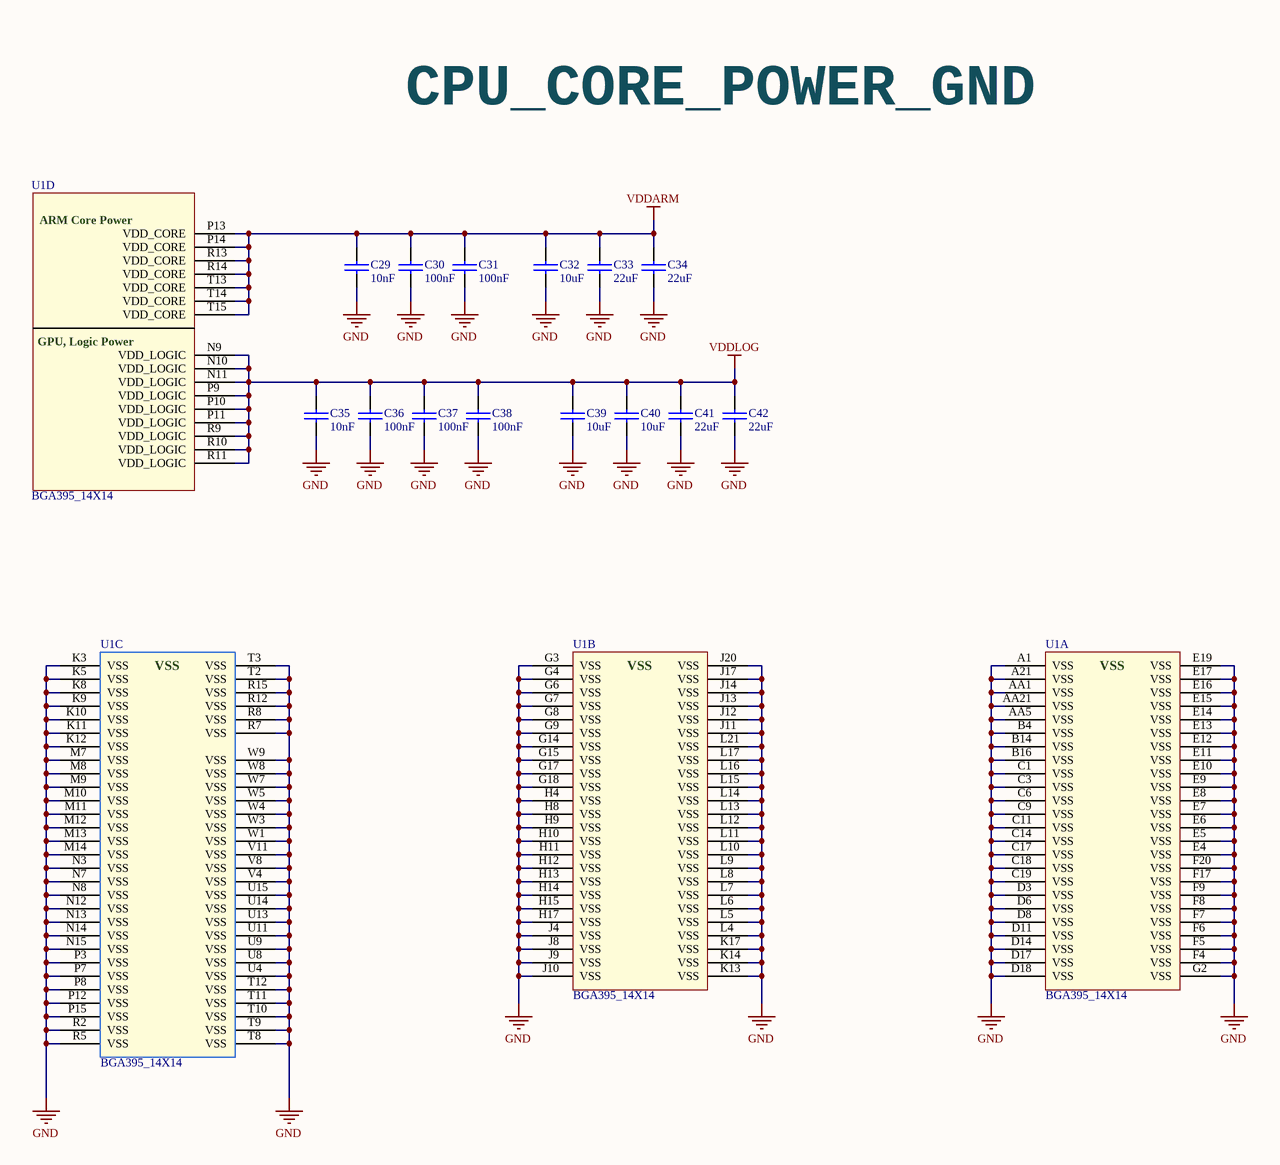
[diagram p3: CPU_CORE_POWER_GND.SchDoc]

### Parts
C29  10nF  [0402_CC - C]
C30  100nF  [0402_CC - C]
C31  100nF  [0402_CC - C]
C32  10uF  [0603_CC]
C33  22uF  [0603_CC]
C34  22uF  [0603_CC]
C35  10nF  [0402_CC - C]
C36  100nF  [0402_CC - C]
C37  100nF  [0402_CC - C]
C38  100nF  [0402_CC - C]
C39  10uF  [0603_CC]
C40  10uF  [0603_CC]
C41  22uF  [0603_CC]
C42  22uF  [0603_CC]
U1  BGA395_14X14  [BGA395C65P21X21_1750X1750X117]  (parts A,B,C,D of 17)

### Nets
GND: C29.2 C30.2 C31.2 C32.2 C33.2 C34.2 C35.2 C36.2 C37.2 C38.2 C39.2 C40.2 C41.2 C42.2 U1.A1(VSS) U1.A21(VSS) U1.AA1(VSS) U1.AA5(VSS) U1.AA21(VSS) U1.B4(VSS) U1.B14(VSS) U1.B16(VSS) U1.C1(VSS) U1.C3(VSS) U1.C6(VSS) U1.C9(VSS) U1.C11(VSS) U1.C14(VSS) U1.C17(VSS) U1.C18(VSS) U1.C19(VSS) U1.D3(VSS) U1.D6(VSS) U1.D8(VSS) U1.D11(VSS) U1.D14(VSS) U1.D17(VSS) U1.D18(VSS) U1.E4(VSS) U1.E5(VSS) U1.E6(VSS) U1.E7(VSS) U1.E8(VSS) U1.E9(VSS) U1.E10(VSS) U1.E11(VSS) U1.E12(VSS) U1.E13(VSS) U1.E14(VSS) U1.E15(VSS) U1.E16(VSS) U1.E17(VSS) U1.E19(VSS) U1.F4(VSS) U1.F5(VSS) U1.F6(VSS) U1.F7(VSS) U1.F8(VSS) U1.F9(VSS) U1.F17(VSS) U1.F20(VSS) U1.G2(VSS) U1.G3(VSS) U1.G4(VSS) U1.G6(VSS) U1.G7(VSS) U1.G8(VSS) U1.G9(VSS) U1.G14(VSS) U1.G15(VSS) U1.G17(VSS) U1.G18(VSS) U1.H4(VSS) U1.H8(VSS) U1.H9(VSS) U1.H10(VSS) U1.H11(VSS) U1.H12(VSS) U1.H13(VSS) U1.H14(VSS) U1.H15(VSS) U1.H17(VSS) U1.J4(VSS) U1.J8(VSS) U1.J9(VSS) U1.J10(VSS) U1.J11(VSS) U1.J12(VSS) U1.J13(VSS) U1.J14(VSS) U1.J17(VSS) U1.J20(VSS) U1.K3(VSS) U1.K5(VSS) U1.K8(VSS) U1.K9(VSS) U1.K10(VSS) U1.K11(VSS) U1.K12(VSS) U1.K13(VSS) U1.K14(VSS) U1.K17(VSS) U1.L4(VSS) U1.L5(VSS) U1.L6(VSS) U1.L7(VSS) U1.L8(VSS) U1.L9(VSS) U1.L10(VSS) U1.L11(VSS) U1.L12(VSS) U1.L13(VSS) U1.L14(VSS) U1.L15(VSS) U1.L16(VSS) U1.L17(VSS) U1.L21(VSS) U1.M7(VSS) U1.M8(VSS) U1.M9(VSS) U1.M10(VSS) U1.M11(VSS) U1.M12(VSS) U1.M13(VSS) U1.M14(VSS) U1.N3(VSS) U1.N7(VSS) U1.N8(VSS) U1.N12(VSS) U1.N13(VSS) U1.N14(VSS) U1.N15(VSS) U1.P3(VSS) U1.P7(VSS) U1.P8(VSS) U1.P12(VSS) U1.P15(VSS) U1.R2(VSS) U1.R5(VSS) U1.R7(VSS) U1.R8(VSS) U1.R12(VSS) U1.R15(VSS) U1.T2(VSS) U1.T3(VSS) U1.T8(VSS) U1.T9(VSS) U1.T10(VSS) U1.T11(VSS) U1.T12(VSS) U1.U4(VSS) U1.U8(VSS) U1.U9(VSS) U1.U11(VSS) U1.U13(VSS) U1.U14(VSS) U1.U15(VSS) U1.V4(VSS) U1.V8(VSS) U1.V11(VSS) U1.W1(VSS) U1.W3(VSS) U1.W4(VSS) U1.W5(VSS) U1.W7(VSS) U1.W8(VSS) U1.W9(VSS)
VDDARM: C29.1 C30.1 C31.1 C32.1 C33.1 C34.1 U1.P13(VDD_CORE) U1.P14(VDD_CORE) U1.R13(VDD_CORE) U1.R14(VDD_CORE) U1.T13(VDD_CORE) U1.T14(VDD_CORE) U1.T15(VDD_CORE)
VDDLOG: C35.1 C36.1 C37.1 C38.1 C39.1 C40.1 C41.1 C42.1 U1.N9(VDD_LOGIC) U1.N10(VDD_LOGIC) U1.N11(VDD_LOGIC) U1.P9(VDD_LOGIC) U1.P10(VDD_LOGIC) U1.P11(VDD_LOGIC) U1.R9(VDD_LOGIC) U1.R10(VDD_LOGIC) U1.R11(VDD_LOGIC)

### Notes on the sheet
- CPU_CORE_POWER_GND
- (in symbol RK3328, part D) ARM Core Power; GPU, Logic Power

### Library data of the parts
C29-C42 = CAP_NP: CLASS: DISCRETE
U1 = RK3328: By AAR

## Sheet CPU_DDR.SchDoc
size A3; SheetNumber: 6; SheetTotal: 21
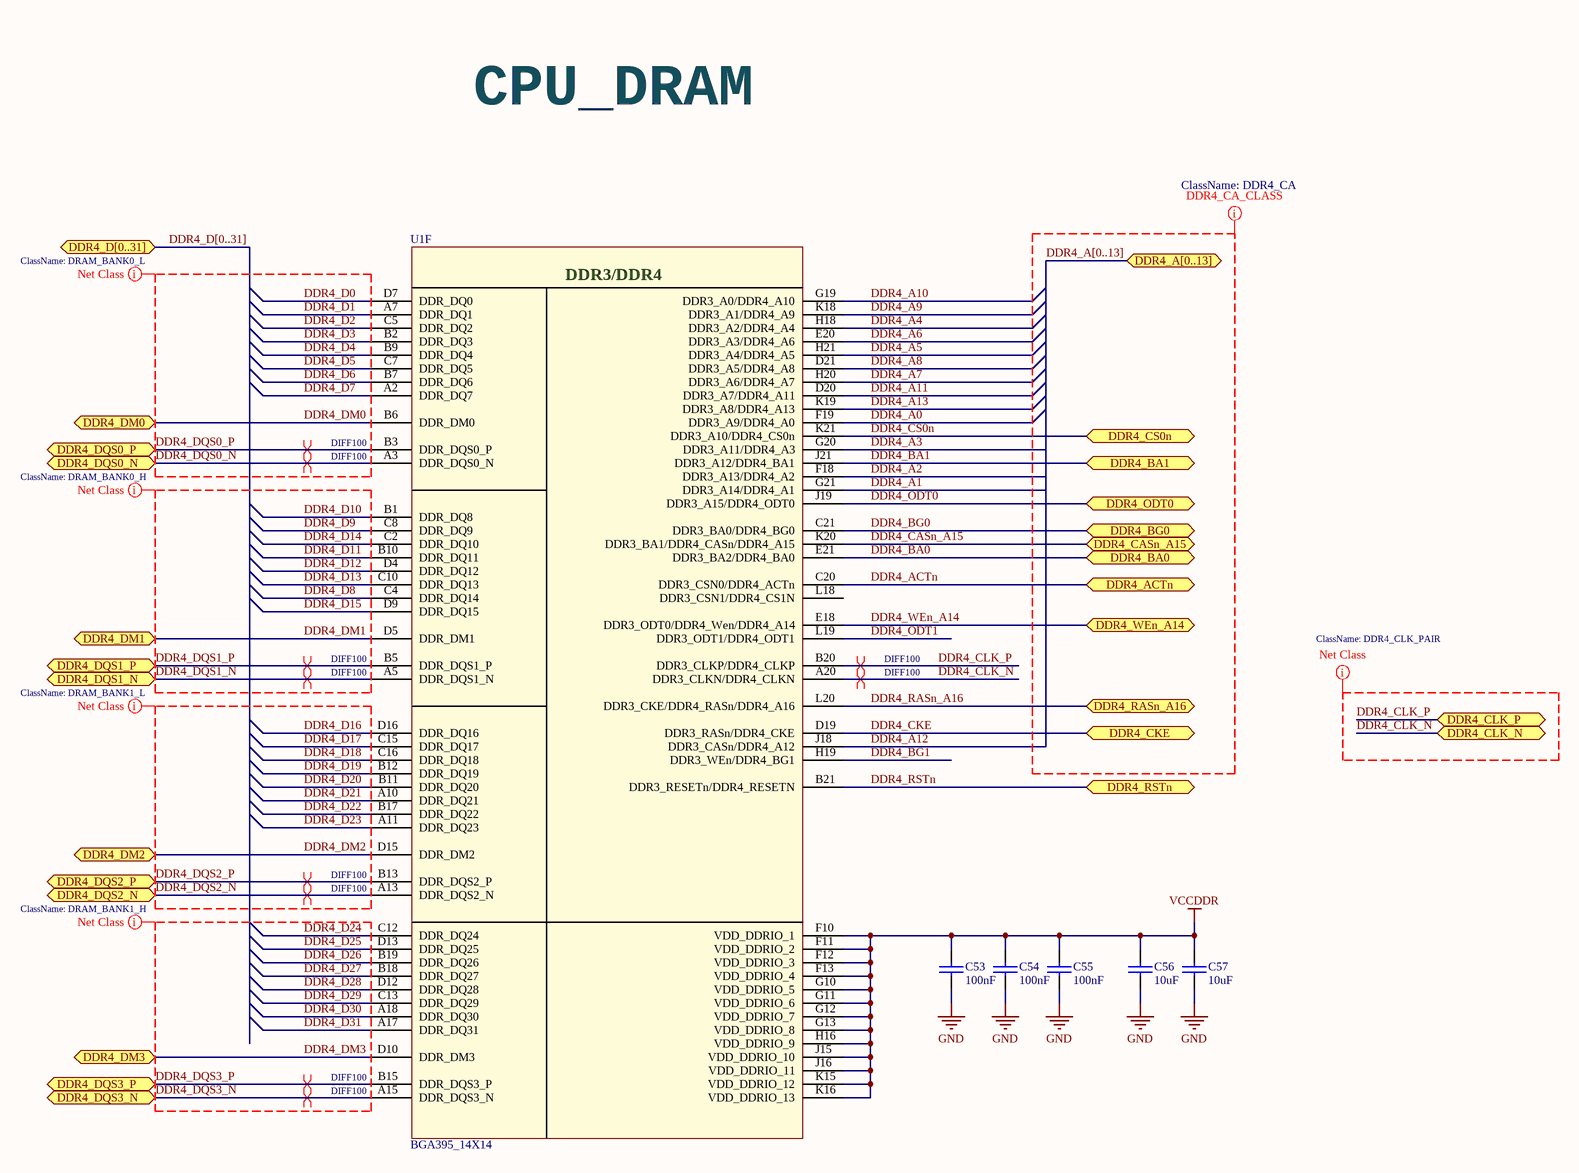
[diagram p4: CPU_DDR.SchDoc]

### Parts
C53  100nF  [0402_CC - C]
C54  100nF  [0402_CC - C]
C55  100nF  [0402_CC - C]
C56  10uF  [0603_CC]
C57  10uF  [0603_CC]
U1  BGA395_14X14  [BGA395C65P21X21_1750X1750X117]  (part F of 17)

### Ports
DDR4_A[0..13] (bidir), DDR4_ACTn (bidir), DDR4_BA0 (bidir), DDR4_BA1 (bidir), DDR4_BG0 (bidir), DDR4_CASn_A15 (bidir), DDR4_CKE (bidir), DDR4_CLK_N (bidir), DDR4_CLK_P (bidir), DDR4_CS0n (bidir), DDR4_D[0..31] (bidir), DDR4_DM0 (bidir), DDR4_DM1 (bidir), DDR4_DM2 (bidir), DDR4_DM3 (bidir), DDR4_DQS0_N (bidir), DDR4_DQS0_P (bidir), DDR4_DQS1_N (bidir), DDR4_DQS1_P (bidir), DDR4_DQS2_N (bidir), DDR4_DQS2_P (bidir), DDR4_DQS3_N (bidir), DDR4_DQS3_P (bidir), DDR4_ODT0 (bidir), DDR4_RASn_A16 (bidir), DDR4_RSTn (bidir), DDR4_WEn_A14 (bidir)

### Nets
GND: C53.2 C54.2 C55.2 C56.2 C57.2
VCCDDR: C53.1 C54.1 C55.1 C56.1 C57.1 U1.F10(VDD_DDRIO_1) U1.F11(VDD_DDRIO_2) U1.F12(VDD_DDRIO_3) U1.F13(VDD_DDRIO_4) U1.G10(VDD_DDRIO_5) U1.G11(VDD_DDRIO_6) U1.G12(VDD_DDRIO_7) U1.G13(VDD_DDRIO_8) U1.H16(VDD_DDRIO_9) U1.J15(VDD_DDRIO_10) U1.J16(VDD_DDRIO_11) U1.K15(VDD_DDRIO_12) U1.K16(VDD_DDRIO_13)
DDR4_A0: U1.F19(DDR3_A9/DDR4_A0)
DDR4_A1: U1.G21(DDR3_A14/DDR4_A1)
DDR4_A2: U1.F18(DDR3_A13/DDR4_A2)
DDR4_A3: U1.G20(DDR3_A11/DDR4_A3)
DDR4_A4: U1.H18(DDR3_A2/DDR4_A4)
DDR4_A5: U1.H21(DDR3_A4/DDR4_A5)
DDR4_A6: U1.E20(DDR3_A3/DDR4_A6)
DDR4_A7: U1.H20(DDR3_A6/DDR4_A7)
DDR4_A8: U1.D21(DDR3_A5/DDR4_A8)
DDR4_A9: U1.K18(DDR3_A1/DDR4_A9)
DDR4_A10: U1.G19(DDR3_A0/DDR4_A10)
DDR4_A11: U1.D20(DDR3_A7/DDR4_A11)
DDR4_A12: U1.J18(DDR3_CASn/DDR4_A12)
DDR4_A13: U1.K19(DDR3_A8/DDR4_A13)
DDR4_ACTn: U1.C20(DDR3_CSN0/DDR4_ACTn) ; port DDR4_ACTn
DDR4_BA0: U1.E21(DDR3_BA2/DDR4_BA0) ; port DDR4_BA0
DDR4_BA1: U1.J21(DDR3_A12/DDR4_BA1) ; port DDR4_BA1
DDR4_BG0: U1.C21(DDR3_BA0/DDR4_BG0) ; port DDR4_BG0
DDR4_BG1: U1.H19(DDR3_WEn/DDR4_BG1)
DDR4_CASn_A15: U1.K20(DDR3_BA1/DDR4_CASn/DDR4_A15) ; port DDR4_CASn_A15
DDR4_CKE: U1.D19(DDR3_RASn/DDR4_CKE) ; port DDR4_CKE
DDR4_CLK_N: U1.A20(DDR3_CLKN/DDR4_CLKN) ; port DDR4_CLK_N
DDR4_CLK_P: U1.B20(DDR3_CLKP/DDR4_CLKP) ; port DDR4_CLK_P
DDR4_CS0n: U1.K21(DDR3_A10/DDR4_CS0n) ; port DDR4_CS0n
DDR4_D0: U1.D7(DDR_DQ0)
DDR4_D1: U1.A7(DDR_DQ1)
DDR4_D2: U1.C5(DDR_DQ2)
DDR4_D3: U1.B2(DDR_DQ3)
DDR4_D4: U1.B9(DDR_DQ4)
DDR4_D5: U1.C7(DDR_DQ5)
DDR4_D6: U1.B7(DDR_DQ6)
DDR4_D7: U1.A2(DDR_DQ7)
DDR4_D8: U1.C4(DDR_DQ14)
DDR4_D9: U1.C8(DDR_DQ9)
DDR4_D10: U1.B1(DDR_DQ8)
DDR4_D11: U1.B10(DDR_DQ11)
DDR4_D12: U1.D4(DDR_DQ12)
DDR4_D13: U1.C10(DDR_DQ13)
DDR4_D14: U1.C2(DDR_DQ10)
DDR4_D15: U1.D9(DDR_DQ15)
DDR4_D16: U1.D16(DDR_DQ16)
DDR4_D17: U1.C15(DDR_DQ17)
DDR4_D18: U1.C16(DDR_DQ18)
DDR4_D19: U1.B12(DDR_DQ19)
DDR4_D20: U1.B11(DDR_DQ20)
DDR4_D21: U1.A10(DDR_DQ21)
DDR4_D22: U1.B17(DDR_DQ22)
DDR4_D23: U1.A11(DDR_DQ23)
DDR4_D24: U1.C12(DDR_DQ24)
DDR4_D25: U1.D13(DDR_DQ25)
DDR4_D26: U1.B19(DDR_DQ26)
DDR4_D27: U1.B18(DDR_DQ27)
DDR4_D28: U1.D12(DDR_DQ28)
DDR4_D29: U1.C13(DDR_DQ29)
DDR4_D30: U1.A18(DDR_DQ30)
DDR4_D31: U1.A17(DDR_DQ31)
DDR4_DM0: U1.B6(DDR_DM0) ; port DDR4_DM0
DDR4_DM1: U1.D5(DDR_DM1) ; port DDR4_DM1
DDR4_DM2: U1.D15(DDR_DM2) ; port DDR4_DM2
DDR4_DM3: U1.D10(DDR_DM3) ; port DDR4_DM3
DDR4_DQS0_N: U1.A3(DDR_DQS0_N) ; port DDR4_DQS0_N
DDR4_DQS0_P: U1.B3(DDR_DQS0_P) ; port DDR4_DQS0_P
DDR4_DQS1_N: U1.A5(DDR_DQS1_N) ; port DDR4_DQS1_N
DDR4_DQS1_P: U1.B5(DDR_DQS1_P) ; port DDR4_DQS1_P
DDR4_DQS2_N: U1.A13(DDR_DQS2_N) ; port DDR4_DQS2_N
DDR4_DQS2_P: U1.B13(DDR_DQS2_P) ; port DDR4_DQS2_P
DDR4_DQS3_N: U1.A15(DDR_DQS3_N) ; port DDR4_DQS3_N
DDR4_DQS3_P: U1.B15(DDR_DQS3_P) ; port DDR4_DQS3_P
DDR4_ODT0: U1.J19(DDR3_A15/DDR4_ODT0) ; port DDR4_ODT0
DDR4_ODT1: U1.L19(DDR3_ODT1/DDR4_ODT1)
DDR4_RASn_A16: U1.L20(DDR3_CKE/DDR4_RASn/DDR4_A16) ; port DDR4_RASn_A16
DDR4_RSTn: U1.B21(DDR3_RESETn/DDR4_RESETN) ; port DDR4_RSTn
DDR4_WEn_A14: U1.E18(DDR3_ODT0/DDR4_Wen/DDR4_A14) ; port DDR4_WEn_A14

Not connected (* = marked no-connect by the designer): U1 L18(DDR3_CSN1/DDR4_CS1N)

### Buses and harness runs
bus DDR4_A[0..13] = port DDR4_A[0..13]
bus DDR4_D[0..31] = port DDR4_D[0..31]

### Layout directives
net class DDR4_CA: DDR4_A[0..13]
net class DRAM_BANK0_L: DDR4_D0, DDR4_D1, DDR4_D2, DDR4_D3, DDR4_D4, DDR4_D5, DDR4_D6, DDR4_D7, DDR4_DM0, DDR4_DQS0_N, DDR4_DQS0_P
net class DRAM_BANK0_H: DDR4_D8, DDR4_D9, DDR4_D10, DDR4_D11, DDR4_D12, DDR4_D13, DDR4_D14, DDR4_D15, DDR4_DM1, DDR4_DQS1_N, DDR4_DQS1_P
net class DRAM_BANK1_L: DDR4_D16, DDR4_D17, DDR4_D18, DDR4_D19, DDR4_D20, DDR4_D21, DDR4_D22, DDR4_D23, DDR4_DM2, DDR4_DQS2_N, DDR4_DQS2_P
net class DRAM_BANK1_H: DDR4_D24, DDR4_D25, DDR4_D26, DDR4_D27, DDR4_D28, DDR4_D29, DDR4_D30, DDR4_D31, DDR4_DM3, DDR4_DQS3_N, DDR4_DQS3_P
differential pair; net class DIFF100: DDR4_CLK_N, DDR4_CLK_P, DDR4_DQS0_N, DDR4_DQS0_P, DDR4_DQS1_N, DDR4_DQS1_P, DDR4_DQS2_N, DDR4_DQS2_P, DDR4_DQS3_N, DDR4_DQS3_P
net class DDR4_CLK_PAIR: DDR4_CLK_N, DDR4_CLK_P

### Notes on the sheet
- CPU_DRAM
- (in symbol RK3328, part F) DDR3/DDR4

### Library data of the parts
C53-C57 = CAP_NP: CLASS: DISCRETE
U1 = RK3328: By AAR

## Sheet DRAM_DDR4.SchDoc
size A3; SheetNumber: 12; SheetTotal: 21
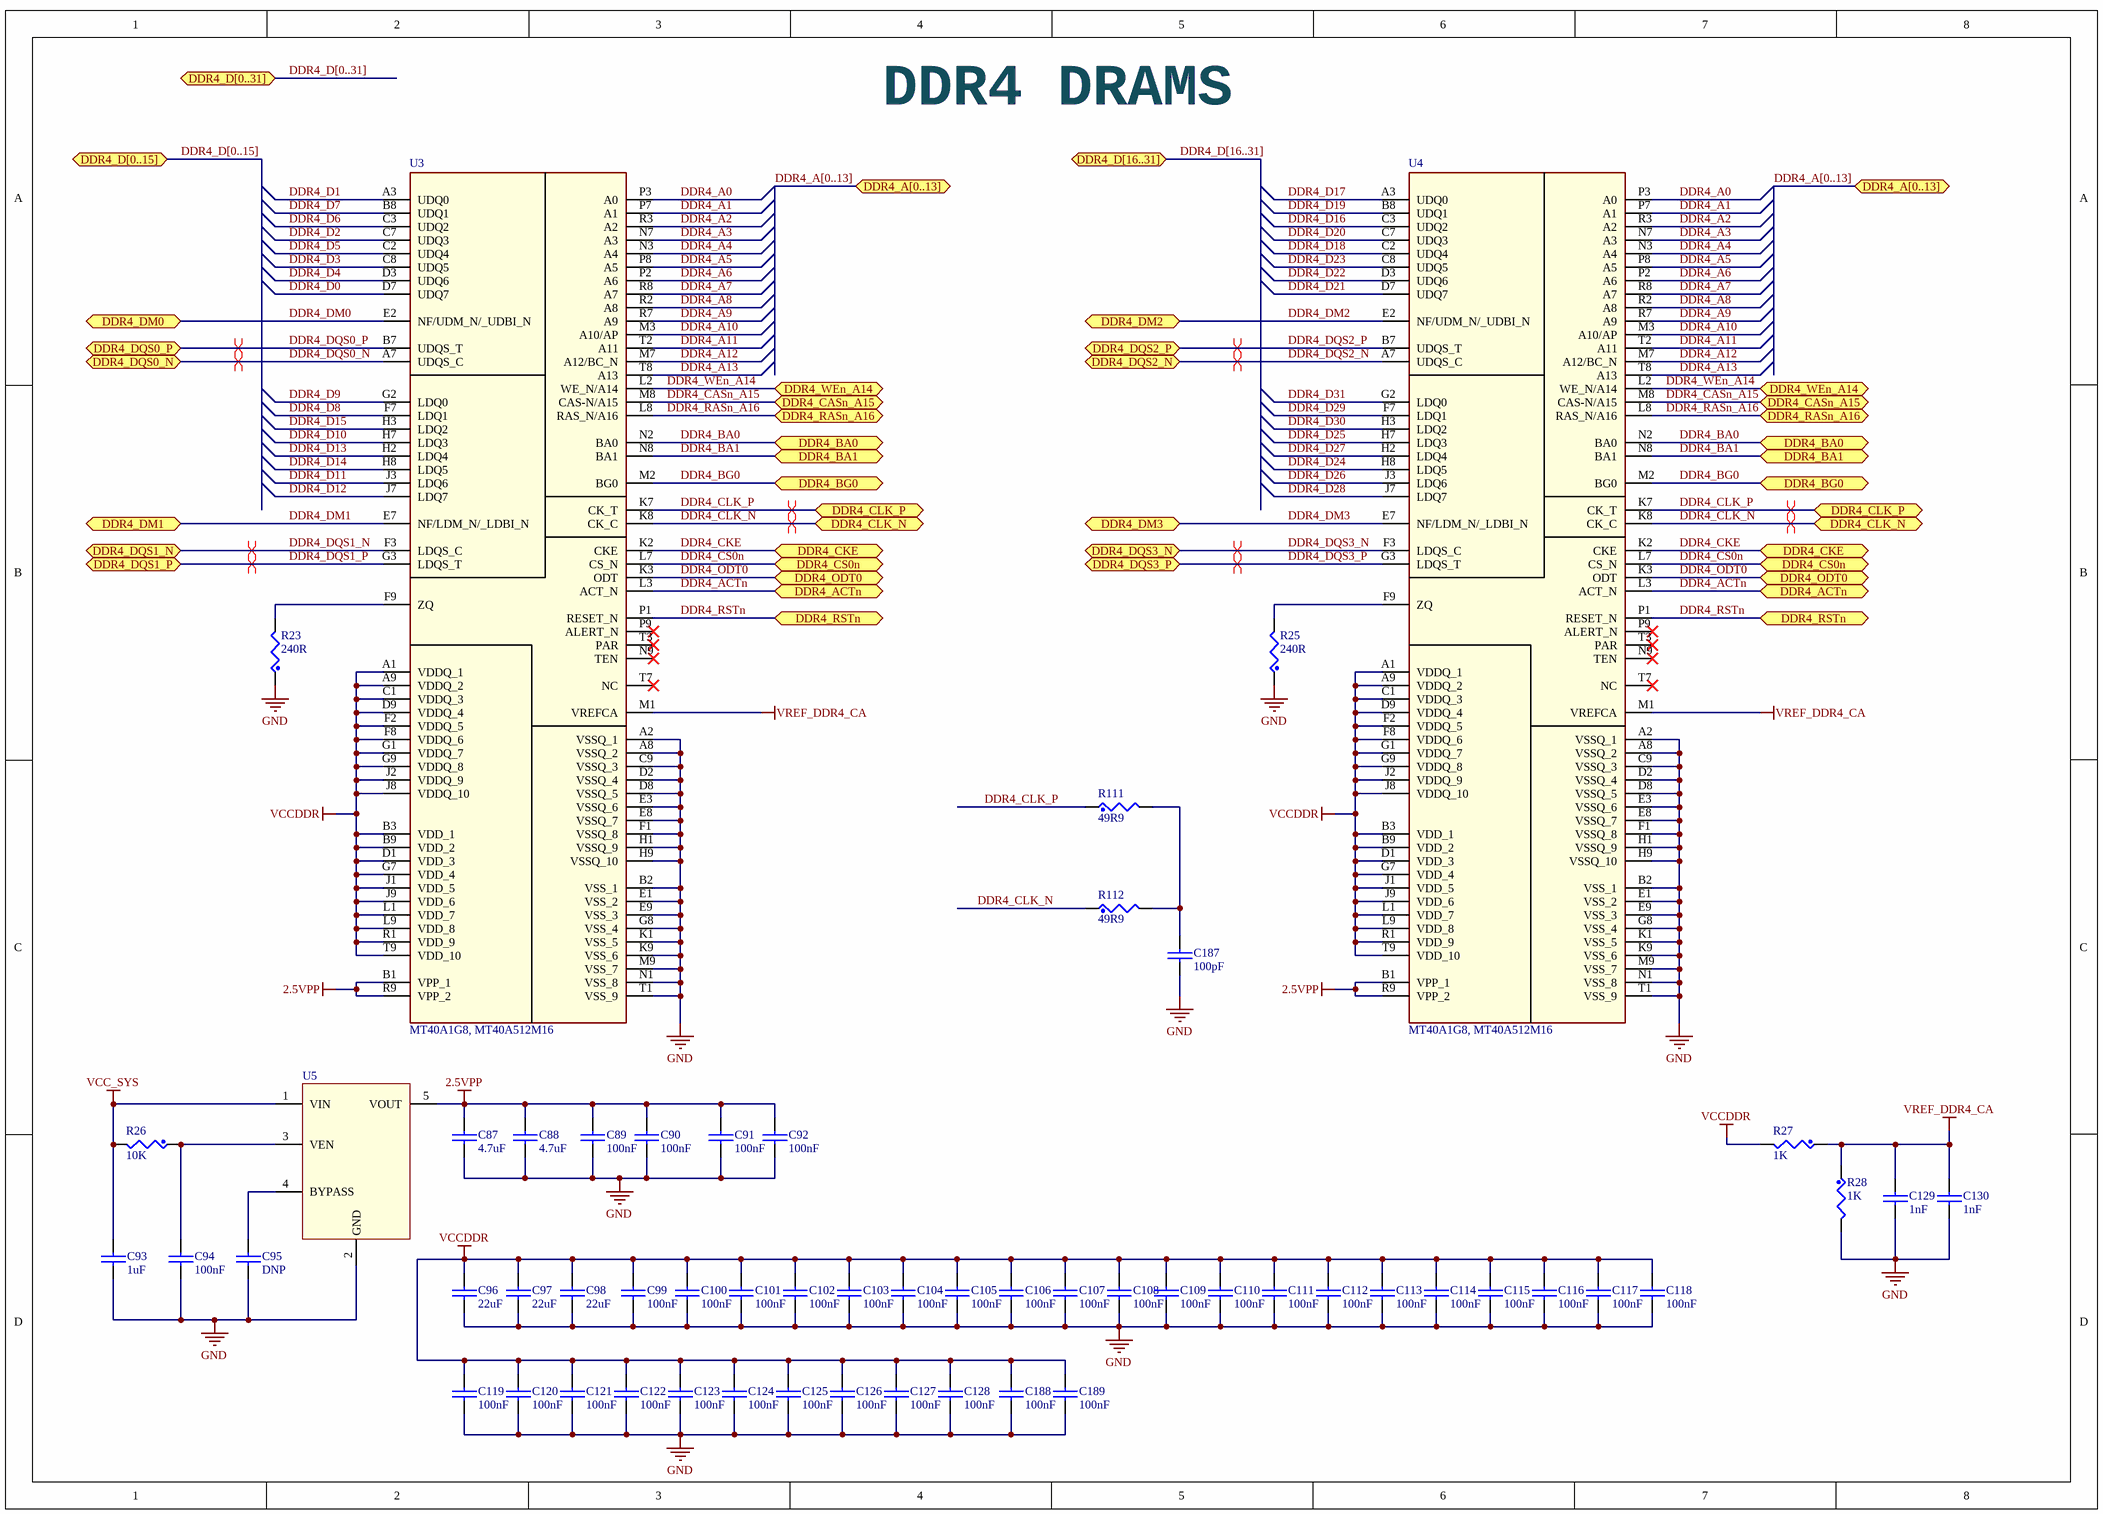
[diagram p5: DRAM_DDR4.SchDoc]

### Parts
C87  4.7uF  [0402_CC - C]
C88  4.7uF  [0402_CC - C]
C89  100nF  [0402_CC - C]
C90  100nF  [0402_CC - C]
C91  100nF  [0402_CC - C]
C92  100nF  [0402_CC - C]
C93  1uF  [0402_CC - C]
C94  100nF  [0402_CC - C]
C95  DNP  [0402_CC - C]
C96  22uF  [0603_CC]
C97  22uF  [0603_CC]
C98  22uF  [0603_CC]
C99  100nF  [0402_CC - C]
C100  100nF  [0402_CC - C]
C101  100nF  [0402_CC - C]
C102  100nF  [0402_CC - C]
C103  100nF  [0402_CC - C]
C104  100nF  [0402_CC - C]
C105  100nF  [0402_CC - C]
C106  100nF  [0402_CC - C]
C107  100nF  [0402_CC - C]
C108  100nF  [0402_CC - C]
C109  100nF  [0402_CC - C]
C110  100nF  [0402_CC - C]
C111  100nF  [0402_CC - C]
C112  100nF  [0402_CC - C]
C113  100nF  [0402_CC - C]
C114  100nF  [0402_CC - C]
C115  100nF  [0402_CC - C]
C116  100nF  [0402_CC - C]
C117  100nF  [0402_CC - C]
C118  100nF  [0402_CC - C]
C119  100nF  [0402_CC - C]
C120  100nF  [0402_CC - C]
C121  100nF  [0402_CC - C]
C122  100nF  [0402_CC - C]
C123  100nF  [0402_CC - C]
C124  100nF  [0402_CC - C]
C125  100nF  [0402_CC - C]
C126  100nF  [0402_CC - C]
C127  100nF  [0402_CC - C]
C128  100nF  [0402_CC - C]
C129  1nF  [0402_CC - C]
C130  1nF  [0402_CC - C]
C187  100pF  [0402_CC - C]
C188  100nF  [0402_CC - C]
C189  100nF  [0402_CC - C]
R23  240R  [0402_CR]
R25  240R  [0402_CR]
R26  10K  [0402_CR]
R27  1K  [0603_CR]
R28  1K  [0603_CR]
R111  49R9  [0402_CR]
R112  49R9  [0402_CR]
U3  MT40A1G8, MT40A512M16  [BGA96C80P9X16_1000X1400X120]
U4  MT40A1G8, MT40A512M16  [BGA96C80P9X16_1000X1400X120]
U5  LDO  [SOT23_5]  (value not drawn)

### Ports
DDR4_A[0..13] (bidir), DDR4_ACTn (bidir), DDR4_BA0 (bidir), DDR4_BA1 (bidir), DDR4_BG0 (bidir), DDR4_CASn_A15 (bidir), DDR4_CKE (bidir), DDR4_CLK_N (bidir), DDR4_CLK_P (bidir), DDR4_CS0n (bidir), DDR4_D[0..15] (bidir), DDR4_D[0..31] (bidir), DDR4_D[16..31] (bidir), DDR4_DM0 (bidir), DDR4_DM1 (bidir), DDR4_DM2 (bidir), DDR4_DM3 (bidir), DDR4_DQS0_N (bidir), DDR4_DQS0_P (bidir), DDR4_DQS1_N (bidir), DDR4_DQS1_P (bidir), DDR4_DQS2_N (bidir), DDR4_DQS2_P (bidir), DDR4_DQS3_N (bidir), DDR4_DQS3_P (bidir), DDR4_ODT0 (bidir), DDR4_RASn_A16 (bidir), DDR4_RSTn (bidir), DDR4_WEn_A14 (bidir)

### Nets
2.5VPP: C87.1 C88.1 C89.1 C90.1 C91.1 C92.1 U3.B1(VPP_1) U3.R9(VPP_2) U4.B1(VPP_1) U4.R9(VPP_2) U5.5(VOUT)
GND: C87.2 C88.2 C89.2 C90.2 C91.2 C92.2 C93.2 C94.2 C95.2 C96.2 C97.2 C98.2 C99.2 C100.2 C101.2 C102.2 C103.2 C104.2 C105.2 C106.2 C107.2 C108.2 C109.2 C110.2 C111.2 C112.2 C113.2 C114.2 C115.2 C116.2 C117.2 C118.2 C119.2 C120.2 C121.2 C122.2 C123.2 C124.2 C125.2 C126.2 C127.2 C128.2 C129.2 C130.2 C187.2 C188.2 C189.2 R23.1 R25.1 R28.2 U3.A2(VSSQ_1) U3.A8(VSSQ_2) U3.B2(VSS_1) U3.C9(VSSQ_3) U3.D2(VSSQ_4) U3.D8(VSSQ_5) U3.E1(VSS_2) U3.E3(VSSQ_6) U3.E8(VSSQ_7) U3.E9(VSS_3) U3.F1(VSSQ_8) U3.G8(VSS_4) U3.H1(VSSQ_9) U3.H9(VSSQ_10) U3.K1(VSS_5) U3.K9(VSS_6) U3.M9(VSS_7) U3.N1(VSS_8) U3.T1(VSS_9) U4.A2(VSSQ_1) U4.A8(VSSQ_2) U4.B2(VSS_1) U4.C9(VSSQ_3) U4.D2(VSSQ_4) U4.D8(VSSQ_5) U4.E1(VSS_2) U4.E3(VSSQ_6) U4.E8(VSSQ_7) U4.E9(VSS_3) U4.F1(VSSQ_8) U4.G8(VSS_4) U4.H1(VSSQ_9) U4.H9(VSSQ_10) U4.K1(VSS_5) U4.K9(VSS_6) U4.M9(VSS_7) U4.N1(VSS_8) U4.T1(VSS_9) U5.2(GND)
VCC_SYS: C93.1 R26.2 U5.1(VIN)
VCCDDR: C96.1 C97.1 C98.1 C99.1 C100.1 C101.1 C102.1 C103.1 C104.1 C105.1 C106.1 C107.1 C108.1 C109.1 C110.1 C111.1 C112.1 C113.1 C114.1 C115.1 C116.1 C117.1 C118.1 C119.1 C120.1 C121.1 C122.1 C123.1 C124.1 C125.1 C126.1 C127.1 C128.1 C188.1 C189.1 R27.2 U3.A1(VDDQ_1) U3.A9(VDDQ_2) U3.B3(VDD_1) U3.B9(VDD_2) U3.C1(VDDQ_3) U3.D1(VDD_3) U3.D9(VDDQ_4) U3.F2(VDDQ_5) U3.F8(VDDQ_6) U3.G1(VDDQ_7) U3.G7(VDD_4) U3.G9(VDDQ_8) U3.J1(VDD_5) U3.J2(VDDQ_9) U3.J8(VDDQ_10) U3.J9(VDD_6) U3.L1(VDD_7) U3.L9(VDD_8) U3.R1(VDD_9) U3.T9(VDD_10) U4.A1(VDDQ_1) U4.A9(VDDQ_2) U4.B3(VDD_1) U4.B9(VDD_2) U4.C1(VDDQ_3) U4.D1(VDD_3) U4.D9(VDDQ_4) U4.F2(VDDQ_5) U4.F8(VDDQ_6) U4.G1(VDDQ_7) U4.G7(VDD_4) U4.G9(VDDQ_8) U4.J1(VDD_5) U4.J2(VDDQ_9) U4.J8(VDDQ_10) U4.J9(VDD_6) U4.L1(VDD_7) U4.L9(VDD_8) U4.R1(VDD_9) U4.T9(VDD_10)
VREF_DDR4_CA: C129.1 C130.1 R27.1 R28.1 U3.M1(VREFCA) U4.M1(VREFCA)
DDR4_A0: U3.P3(A0) U4.P3(A0)
DDR4_A1: U3.P7(A1) U4.P7(A1)
DDR4_A2: U3.R3(A2) U4.R3(A2)
DDR4_A3: U3.N7(A3) U4.N7(A3)
DDR4_A4: U3.N3(A4) U4.N3(A4)
DDR4_A5: U3.P8(A5) U4.P8(A5)
DDR4_A6: U3.P2(A6) U4.P2(A6)
DDR4_A7: U3.R8(A7) U4.R8(A7)
DDR4_A8: U3.R2(A8) U4.R2(A8)
DDR4_A9: U3.R7(A9) U4.R7(A9)
DDR4_A10: U3.M3(A10/AP) U4.M3(A10/AP)
DDR4_A11: U3.T2(A11) U4.T2(A11)
DDR4_A12: U3.M7(A12/BC_N) U4.M7(A12/BC_N)
DDR4_A13: U3.T8(A13) U4.T8(A13)
DDR4_ACTn: U3.L3(ACT_N) U4.L3(ACT_N) ; port DDR4_ACTn
DDR4_BA0: U3.N2(BA0) U4.N2(BA0) ; port DDR4_BA0
DDR4_BA1: U3.N8(BA1) U4.N8(BA1) ; port DDR4_BA1
DDR4_BG0: U3.M2(BG0) U4.M2(BG0) ; port DDR4_BG0
DDR4_CASn_A15: U3.M8(CAS-N/A15) U4.M8(CAS-N/A15) ; port DDR4_CASn_A15
DDR4_CKE: U3.K2(CKE) U4.K2(CKE) ; port DDR4_CKE
DDR4_CLK_N: R112.1 U3.K8(CK_C) U4.K8(CK_C) ; port DDR4_CLK_N
DDR4_CLK_P: R111.1 U3.K7(CK_T) U4.K7(CK_T) ; port DDR4_CLK_P
DDR4_CS0n: U3.L7(CS_N) U4.L7(CS_N) ; port DDR4_CS0n
DDR4_D0: U3.D7(UDQ7)
DDR4_D1: U3.A3(UDQ0)
DDR4_D2: U3.C7(UDQ3)
DDR4_D3: U3.C8(UDQ5)
DDR4_D4: U3.D3(UDQ6)
DDR4_D5: U3.C2(UDQ4)
DDR4_D6: U3.C3(UDQ2)
DDR4_D7: U3.B8(UDQ1)
DDR4_D8: U3.F7(LDQ1)
DDR4_D9: U3.G2(LDQ0)
DDR4_D10: U3.H7(LDQ3)
DDR4_D11: U3.J3(LDQ6)
DDR4_D12: U3.J7(LDQ7)
DDR4_D13: U3.H2(LDQ4)
DDR4_D14: U3.H8(LDQ5)
DDR4_D15: U3.H3(LDQ2)
DDR4_D16: U4.C3(UDQ2)
DDR4_D17: U4.A3(UDQ0)
DDR4_D18: U4.C2(UDQ4)
DDR4_D19: U4.B8(UDQ1)
DDR4_D20: U4.C7(UDQ3)
DDR4_D21: U4.D7(UDQ7)
DDR4_D22: U4.D3(UDQ6)
DDR4_D23: U4.C8(UDQ5)
DDR4_D24: U4.H8(LDQ5)
DDR4_D25: U4.H7(LDQ3)
DDR4_D26: U4.J3(LDQ6)
DDR4_D27: U4.H2(LDQ4)
DDR4_D28: U4.J7(LDQ7)
DDR4_D29: U4.F7(LDQ1)
DDR4_D30: U4.H3(LDQ2)
DDR4_D31: U4.G2(LDQ0)
DDR4_DM0: U3.E2(NF/UDM_N/_UDBI_N) ; port DDR4_DM0
DDR4_DM1: U3.E7(NF/LDM_N/_LDBI_N) ; port DDR4_DM1
DDR4_DM2: U4.E2(NF/UDM_N/_UDBI_N) ; port DDR4_DM2
DDR4_DM3: U4.E7(NF/LDM_N/_LDBI_N) ; port DDR4_DM3
DDR4_DQS0_N: U3.A7(UDQS_C) ; port DDR4_DQS0_N
DDR4_DQS0_P: U3.B7(UDQS_T) ; port DDR4_DQS0_P
DDR4_DQS1_N: U3.F3(LDQS_C) ; port DDR4_DQS1_N
DDR4_DQS1_P: U3.G3(LDQS_T) ; port DDR4_DQS1_P
DDR4_DQS2_N: U4.A7(UDQS_C) ; port DDR4_DQS2_N
DDR4_DQS2_P: U4.B7(UDQS_T) ; port DDR4_DQS2_P
DDR4_DQS3_N: U4.F3(LDQS_C) ; port DDR4_DQS3_N
DDR4_DQS3_P: U4.G3(LDQS_T) ; port DDR4_DQS3_P
DDR4_ODT0: U3.K3(ODT) U4.K3(ODT) ; port DDR4_ODT0
DDR4_RASn_A16: U3.L8(RAS_N/A16) U4.L8(RAS_N/A16) ; port DDR4_RASn_A16
DDR4_RSTn: U3.P1(RESET_N) U4.P1(RESET_N) ; port DDR4_RSTn
DDR4_WEn_A14: U3.L2(WE_N/A14) U4.L2(WE_N/A14) ; port DDR4_WEn_A14
NetC94_1: C94.1 R26.1 U5.3(VEN)
NetC95_1: C95.1 U5.4(BYPASS)
NetC187_1: C187.1 R111.2 R112.2
NetR23_2: R23.2 U3.F9(ZQ)
NetR25_2: R25.2 U4.F9(ZQ)

Not connected (* = marked no-connect by the designer): U3 N9(TEN)* P9(ALERT_N)* T3(PAR)* T7(NC)*; U4 N9(TEN)* P9(ALERT_N)* T3(PAR)* T7(NC)*

### Buses and harness runs
bus DDR4_A[0..13] = port DDR4_A[0..13]
bus DDR4_D[0..15] = port DDR4_D[0..15]
bus DDR4_D[0..31] = port DDR4_D[0..31]
bus DDR4_D[16..31] = port DDR4_D[16..31]

### Layout directives
differential pair: DDR4_CLK_N, DDR4_CLK_P, DDR4_DQS0_N, DDR4_DQS0_P, DDR4_DQS1_N, DDR4_DQS1_P, DDR4_DQS2_N, DDR4_DQS2_P, DDR4_DQS3_N, DDR4_DQS3_P

### Notes on the sheet
- DDR4 DRAMS

### Library data of the parts
C87-C130 C187-C189 = CAP_NP: CLASS: DISCRETE
R23 R25-R28 R111 R112 = RES: CLASS: DISCRETE
U3 U4 = MT40A1G8: AAR, MT40A, DDR4 , 96-Ball x16; Manufacturer_Name: Micron; Manufacturer_Part_Number: MT40A1G16HBA-083E; Datasheet Link: https://pdf1.alldatasheet.com/datasheet-pdf/view/928214/MICRON/MT40A1G16HBA-083E.html; Height: 1.2mm; Package/Case: FBGA96
U5 = PT5108: PT5108  , High-PSRR 500mA LDO, By AAR

## Sheet CPU_eMMC_TF.SchDoc
size A3; SheetNumber: 8; SheetTotal: 21
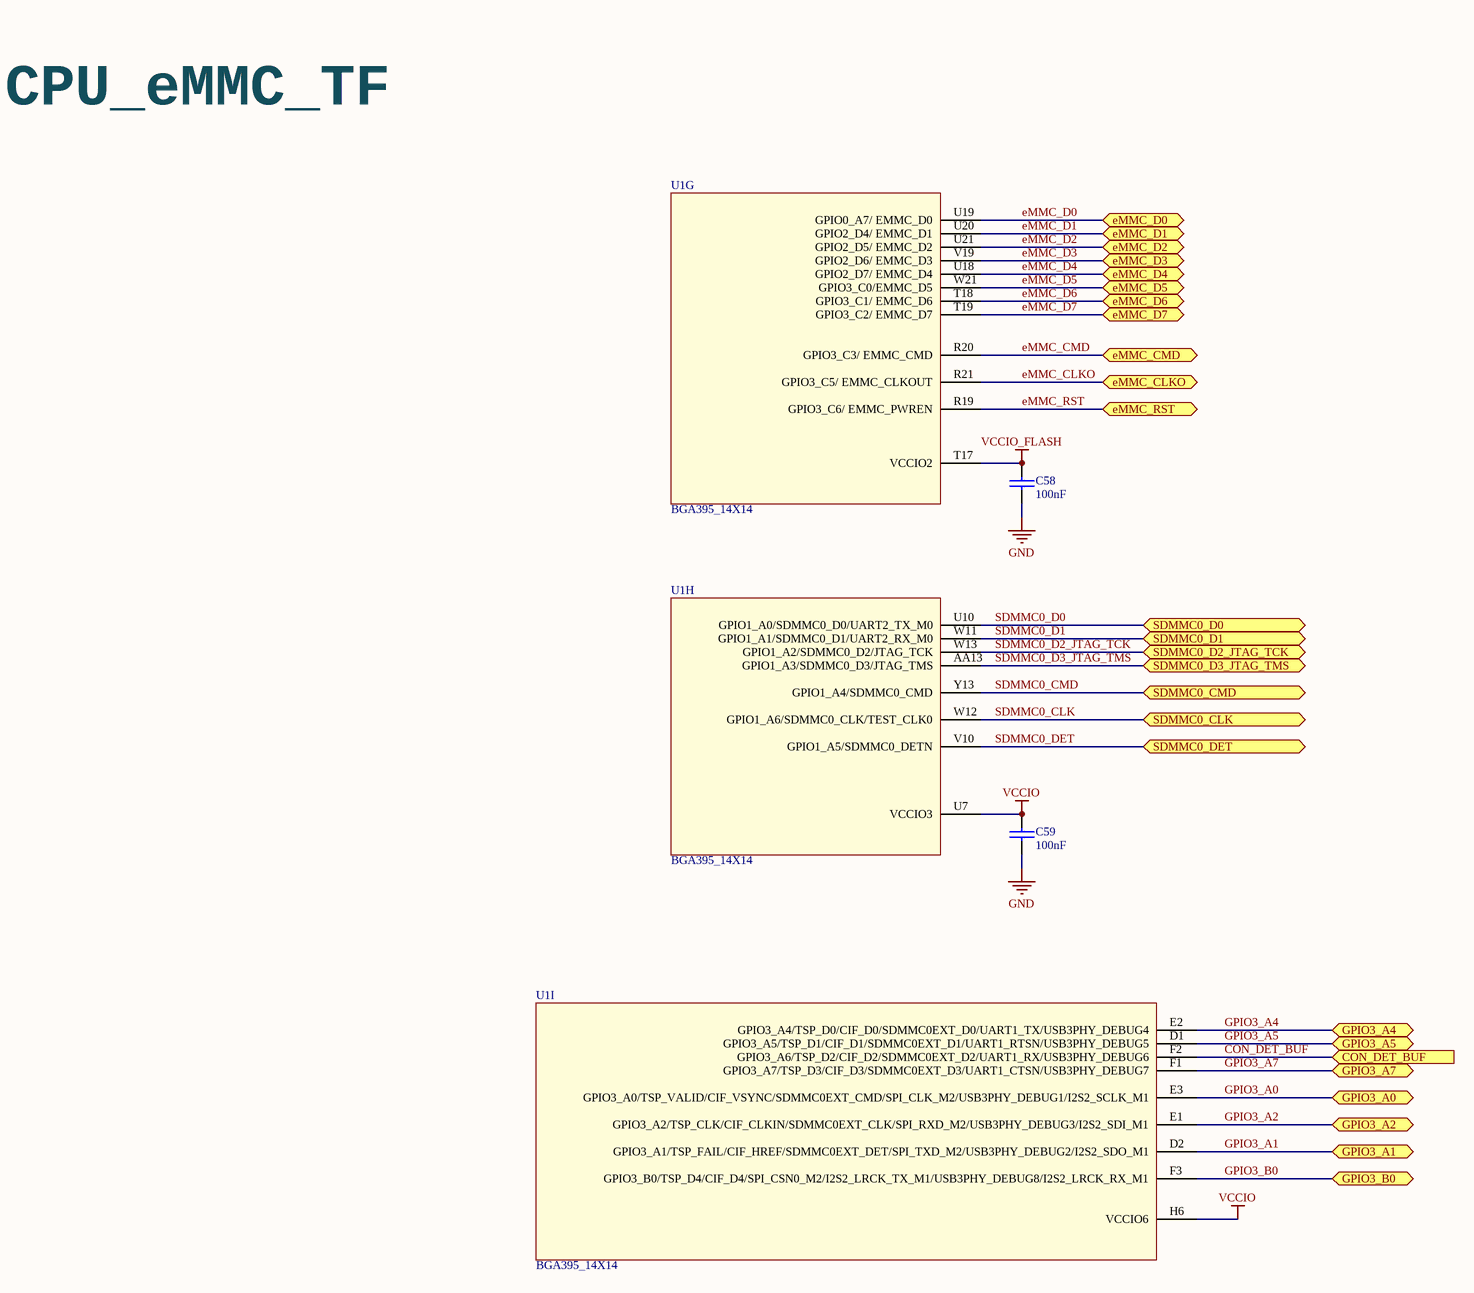
[diagram p6: CPU_eMMC_TF.SchDoc]

### Parts
C58  100nF  [0402_CC - C]
C59  100nF  [0402_CC - C]
U1  BGA395_14X14  [BGA395C65P21X21_1750X1750X117]  (parts G,H,I of 17)

### Ports
CON_DET_BUF (in), eMMC_CLKO (bidir), eMMC_CMD (bidir), eMMC_D0 (bidir), eMMC_D1 (bidir), eMMC_D2 (bidir), eMMC_D3 (bidir), eMMC_D4 (bidir), eMMC_D5 (bidir), eMMC_D6 (bidir), eMMC_D7 (bidir), eMMC_RST (bidir), GPIO3_A0 (bidir), GPIO3_A1 (bidir), GPIO3_A2 (bidir), GPIO3_A4 (bidir), GPIO3_A5 (bidir), GPIO3_A7 (bidir), GPIO3_B0 (bidir), SDMMC0_CLK (bidir), SDMMC0_CMD (bidir), SDMMC0_D0 (bidir), SDMMC0_D1 (bidir), SDMMC0_D2_JTAG_TCK (bidir), SDMMC0_D3_JTAG_TMS (bidir), SDMMC0_DET (bidir)

### Nets
GND: C58.2 C59.2
VCCIO: C59.1 U1.H6(VCCIO6) U1.U7(VCCIO3)
VCCIO_FLASH: C58.1 U1.T17(VCCIO2)
CON_DET_BUF: U1.F2(GPIO3_A6/TSP_D2/CIF_D2/SDMMC0EXT_D2/UART1_RX/USB3PHY_DEBUG6) ; port CON_DET_BUF
eMMC_CLKO: U1.R21(GPIO3_C5/_EMMC_CLKOUT) ; port eMMC_CLKO
eMMC_CMD: U1.R20(GPIO3_C3/_EMMC_CMD) ; port eMMC_CMD
eMMC_D0: U1.U19(GPIO0_A7/_EMMC_D0) ; port eMMC_D0
eMMC_D1: U1.U20(GPIO2_D4/_EMMC_D1) ; port eMMC_D1
eMMC_D2: U1.U21(GPIO2_D5/_EMMC_D2) ; port eMMC_D2
eMMC_D3: U1.V19(GPIO2_D6/_EMMC_D3) ; port eMMC_D3
eMMC_D4: U1.U18(GPIO2_D7/_EMMC_D4) ; port eMMC_D4
eMMC_D5: U1.W21(GPIO3_C0/EMMC_D5) ; port eMMC_D5
eMMC_D6: U1.T18(GPIO3_C1/_EMMC_D6) ; port eMMC_D6
eMMC_D7: U1.T19(GPIO3_C2/_EMMC_D7) ; port eMMC_D7
eMMC_RST: U1.R19(GPIO3_C6/_EMMC_PWREN) ; port eMMC_RST
GPIO3_A0: U1.E3(GPIO3_A0/TSP_VALID/CIF_VSYNC/SDMMC0EXT_CMD/SPI_CLK_M2/USB3PHY_DEBUG1/I2S2_SCLK_M1) ; port GPIO3_A0
GPIO3_A1: U1.D2(GPIO3_A1/TSP_FAIL/CIF_HREF/SDMMC0EXT_DET/SPI_TXD_M2/USB3PHY_DEBUG2/I2S2_SDO_M1) ; port GPIO3_A1
GPIO3_A2: U1.E1(GPIO3_A2/TSP_CLK/CIF_CLKIN/SDMMC0EXT_CLK/SPI_RXD_M2/USB3PHY_DEBUG3/I2S2_SDI_M1) ; port GPIO3_A2
GPIO3_A4: U1.E2(GPIO3_A4/TSP_D0/CIF_D0/SDMMC0EXT_D0/UART1_TX/USB3PHY_DEBUG4) ; port GPIO3_A4
GPIO3_A5: U1.D1(GPIO3_A5/TSP_D1/CIF_D1/SDMMC0EXT_D1/UART1_RTSN/USB3PHY_DEBUG5) ; port GPIO3_A5
GPIO3_A7: U1.F1(GPIO3_A7/TSP_D3/CIF_D3/SDMMC0EXT_D3/UART1_CTSN/USB3PHY_DEBUG7) ; port GPIO3_A7
GPIO3_B0: U1.F3(GPIO3_B0/TSP_D4/CIF_D4/SPI_CSN0_M2/I2S2_LRCK_TX_M1/USB3PHY_DEBUG8/I2S2_LRCK_RX_M1) ; port GPIO3_B0
SDMMC0_CLK: U1.W12(GPIO1_A6/SDMMC0_CLK/TEST_CLK0) ; port SDMMC0_CLK
SDMMC0_CMD: U1.Y13(GPIO1_A4/SDMMC0_CMD) ; port SDMMC0_CMD
SDMMC0_D0: U1.U10(GPIO1_A0/SDMMC0_D0/UART2_TX_M0) ; port SDMMC0_D0
SDMMC0_D1: U1.W11(GPIO1_A1/SDMMC0_D1/UART2_RX_M0) ; port SDMMC0_D1
SDMMC0_D2_JTAG_TCK: U1.W13(GPIO1_A2/SDMMC0_D2/JTAG_TCK) ; port SDMMC0_D2_JTAG_TCK
SDMMC0_D3_JTAG_TMS: U1.AA13(GPIO1_A3/SDMMC0_D3/JTAG_TMS) ; port SDMMC0_D3_JTAG_TMS
SDMMC0_DET: U1.V10(GPIO1_A5/SDMMC0_DETN) ; port SDMMC0_DET

### Notes on the sheet
- CPU_eMMC_TF

### Library data of the parts
C58 C59 = CAP_NP: CLASS: DISCRETE
U1 = RK3328: By AAR

## Sheet eMMC_SD.SchDoc
size A3; SheetNumber: 18; SheetTotal: 21
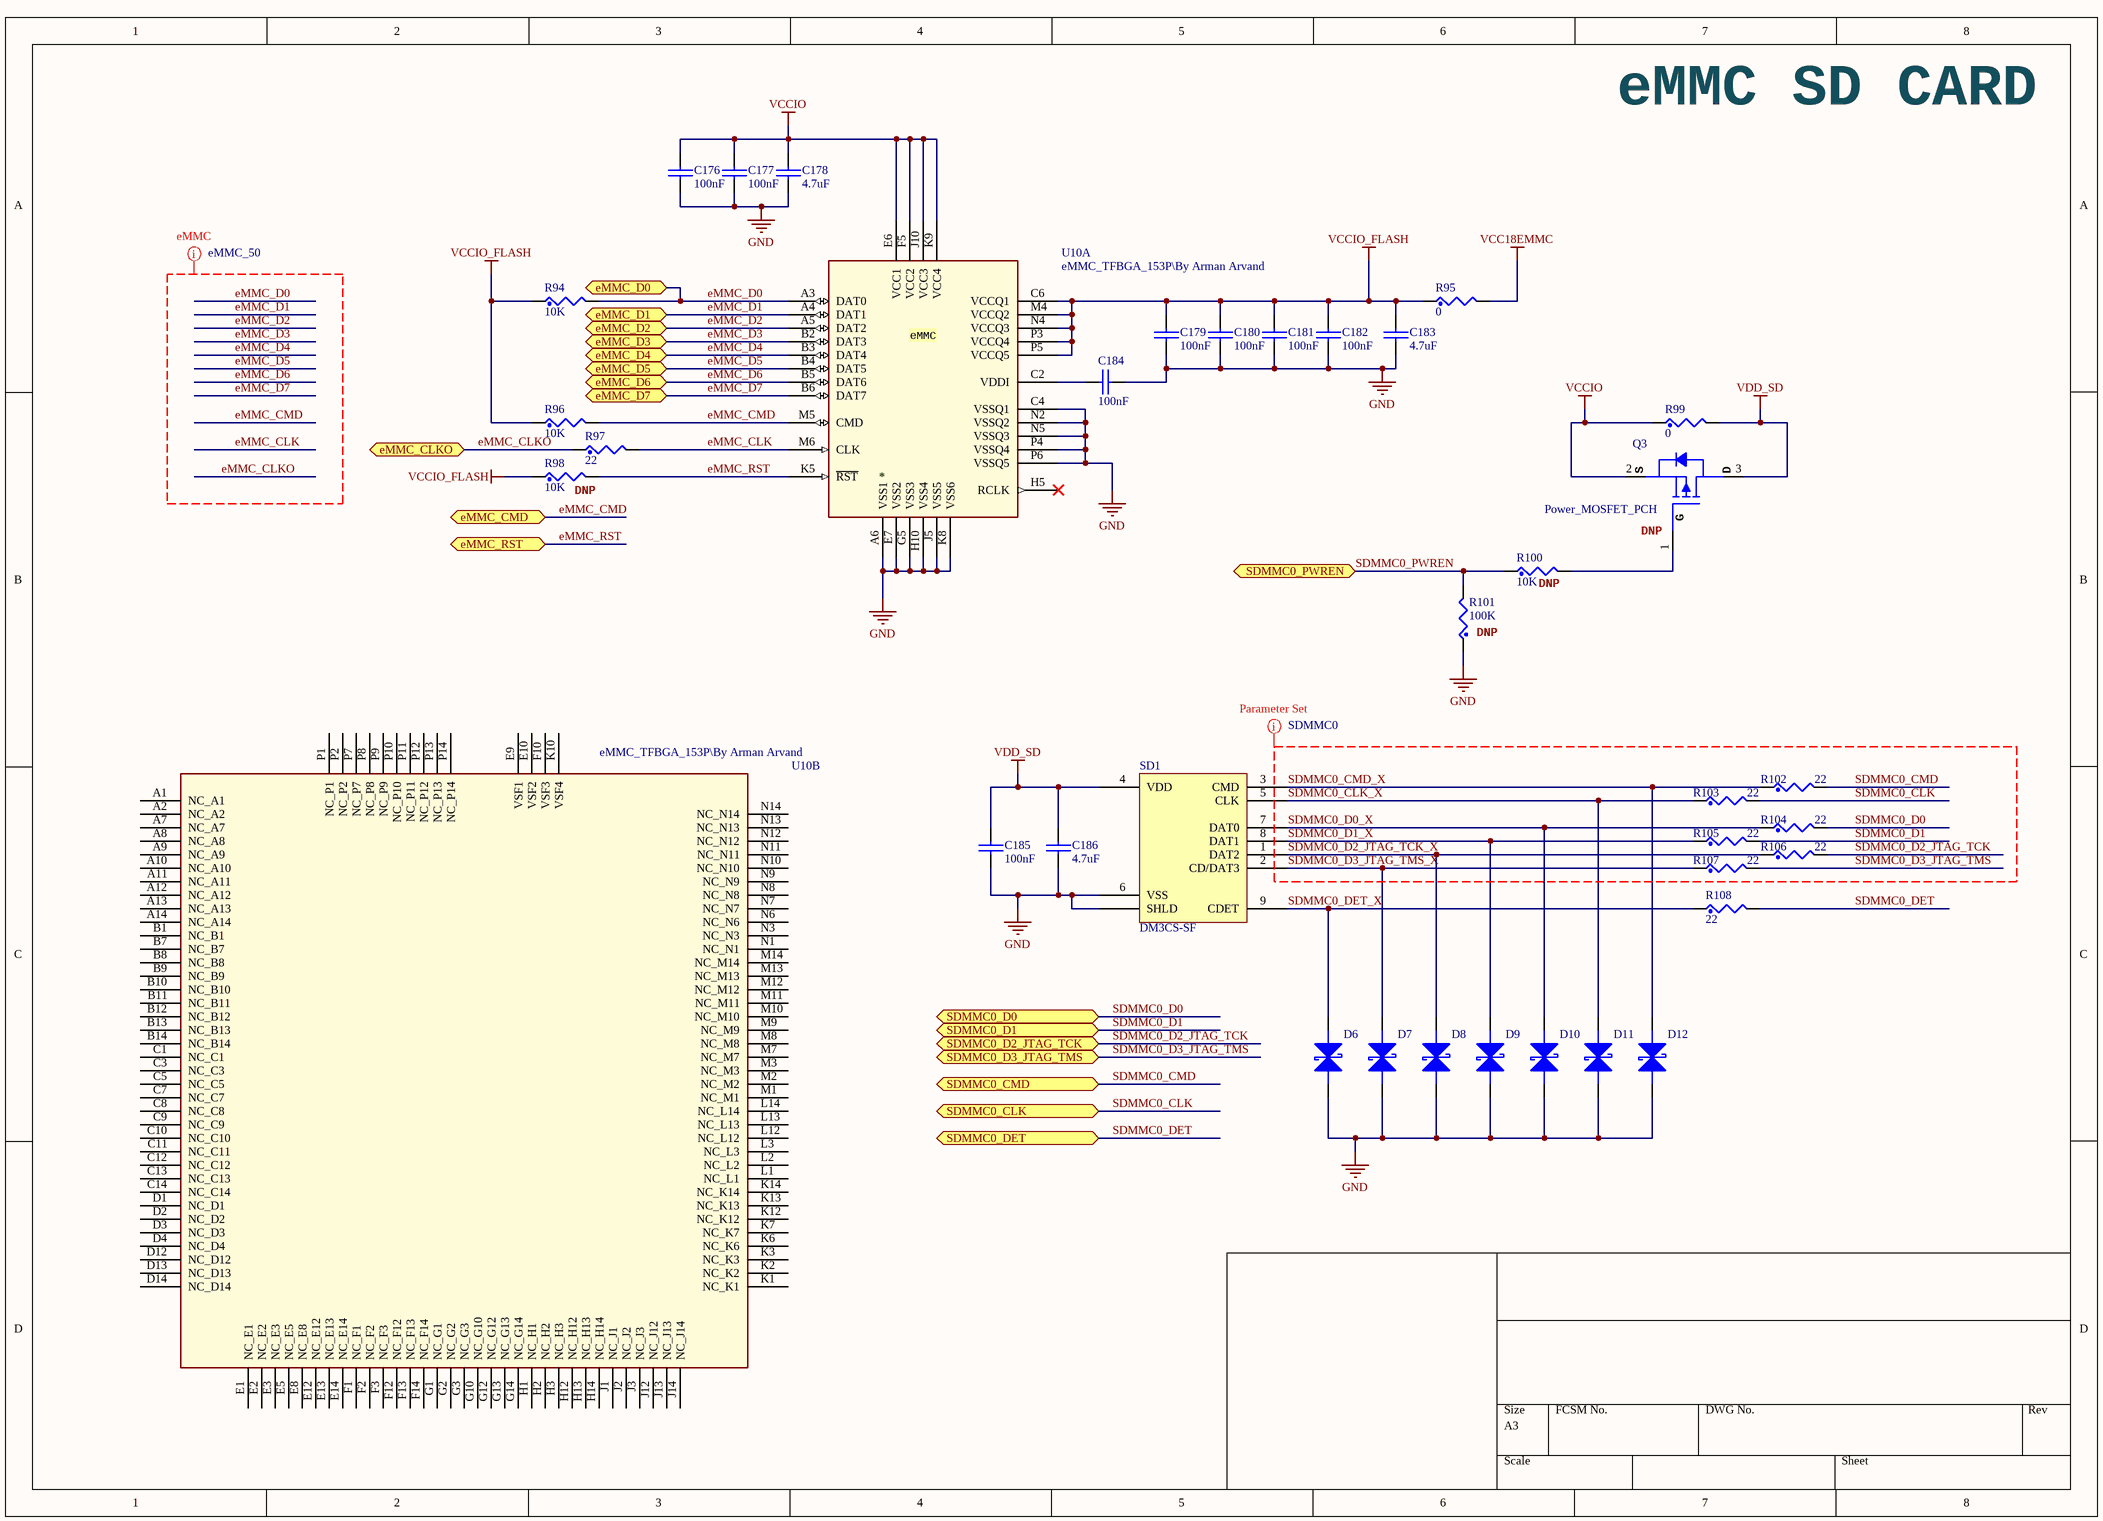
[diagram p7: eMMC_SD.SchDoc]

### Parts
C176  100nF  [0402_CC - C]
C177  100nF  [0402_CC - C]
C178  4.7uF  [0603_CC]
C179  100nF  [0402_CC - C]
C180  100nF  [0402_CC - C]
C181  100nF  [0402_CC - C]
C182  100nF  [0402_CC - C]
C183  4.7uF  [0603_CC]
C184  100nF  [0402_CC - C]
C185  100nF  [0402_CC - C]
C186  4.7uF  [0603_CC]
D6  PGB1010603MR  [TVS0603]  (value not drawn)
D7  PGB1010603MR  [TVS0603]  (value not drawn)
D8  PGB1010603MR  [TVS0603]  (value not drawn)
D9  PGB1010603MR  [TVS0603]  (value not drawn)
D10  PGB1010603MR  [TVS0603]  (value not drawn)
D11  PGB1010603MR  [TVS0603]  (value not drawn)
D12  PGB1010603MR  [TVS0603]  (value not drawn)
Q3  Power_MOSFET_PCH  [SOT95P240X130-3N]
R94  10K  [0402_CR]
R95  0  [0402_CR]
R96  10K  [0402_CR]
R97  22  [0402_CR]
R98  10K  [0402_CR]
R99  0  [0402_CR]
R100  10K  [0402_CR]
R101  100K  [0402_CR]
R102  22  [0402_CR]
R103  22  [0402_CR]
R104  22  [0402_CR]
R105  22  [0402_CR]
R106  22  [0402_CR]
R107  22  [0402_CR]
R108  22  [0402_CR]
SD1  DM3CS-SF  [HIROSE DM3CS]
U10  eMMC_TFBGA_153P\By Arman Arvand  [TFBGA153_0P5_11.5X13X1.2]  (parts A,B of 2)

### Ports
eMMC_CLKO (bidir), eMMC_CMD (bidir), eMMC_D0 (bidir), eMMC_D1 (bidir), eMMC_D2 (bidir), eMMC_D3 (bidir), eMMC_D4 (bidir), eMMC_D5 (bidir), eMMC_D6 (bidir), eMMC_D7 (bidir), eMMC_RST (bidir), SDMMC0_CLK (bidir), SDMMC0_CMD (bidir), SDMMC0_D0 (bidir), SDMMC0_D1 (bidir), SDMMC0_D2_JTAG_TCK (bidir), SDMMC0_D3_JTAG_TMS (bidir), SDMMC0_DET (bidir), SDMMC0_PWREN (bidir)

### Nets
GND: C176.2 C177.2 C178.2 C179.2 C180.2 C181.2 C182.2 C183.2 C184.2 C185.2 C186.2 D6.2 D7.2 D8.2 D9.2 D10.2 D11.2 D12.2 R101.1 SD1.6(VSS) SD1.S(SHLD) U10.A6(VSS1) U10.C4(VSSQ1) U10.E7(VSS2) U10.G5(VSS3) U10.H10(VSS4) U10.J5(VSS5) U10.K8(VSS6) U10.N2(VSSQ2) U10.N5(VSSQ3) U10.P4(VSSQ4) U10.P6(VSSQ5)
VCC18EMMC: R95.2
VCCIO: C176.1 C177.1 C178.1 Q3.2 R99.1 U10.E6(VCC1) U10.F5(VCC2) U10.J10(VCC3) U10.K9(VCC4)
VCCIO_FLASH: C179.1 C180.1 C181.1 C182.1 C183.1 R94.1 R95.1 R96.1 R98.1 U10.C6(VCCQ1) U10.M4(VCCQ2) U10.N4(VCCQ3) U10.P3(VCCQ4) U10.P5(VCCQ5)
VDD_SD: C185.1 C186.1 Q3.3 R99.2 SD1.4(VDD)
eMMC_CLK: R97.2 U10.M6(CLK)
eMMC_CLKO: R97.1 ; port eMMC_CLKO
eMMC_CMD: R96.2 U10.M5(CMD) ; port eMMC_CMD
eMMC_D0: R94.2 U10.A3(DAT0) ; port eMMC_D0
eMMC_D1: U10.A4(DAT1) ; port eMMC_D1
eMMC_D2: U10.A5(DAT2) ; port eMMC_D2
eMMC_D3: U10.B2(DAT3) ; port eMMC_D3
eMMC_D4: U10.B3(DAT4) ; port eMMC_D4
eMMC_D5: U10.B4(DAT5) ; port eMMC_D5
eMMC_D6: U10.B5(DAT6) ; port eMMC_D6
eMMC_D7: U10.B6(DAT7) ; port eMMC_D7
eMMC_RST: R98.2 U10.K5(~{RST}) ; port eMMC_RST
SDMMC0_CLK: R103.2 ; port SDMMC0_CLK
SDMMC0_CLK_X: D11.1 R103.1 SD1.5(CLK)
SDMMC0_CMD: R102.2 ; port SDMMC0_CMD
SDMMC0_CMD_X: D12.1 R102.1 SD1.3(CMD)
SDMMC0_D0: R104.2 ; port SDMMC0_D0
SDMMC0_D0_X: D10.1 R104.1 SD1.7(DAT0)
SDMMC0_D1: R105.2 ; port SDMMC0_D1
SDMMC0_D1_X: D9.1 R105.1 SD1.8(DAT1)
SDMMC0_D2_JTAG_TCK: R106.2 ; port SDMMC0_D2_JTAG_TCK
SDMMC0_D2_JTAG_TCK_X: D8.1 R106.1 SD1.1(DAT2)
SDMMC0_D3_JTAG_TMS: R107.2 ; port SDMMC0_D3_JTAG_TMS
SDMMC0_D3_JTAG_TMS_X: D7.1 R107.1 SD1.2(CD/DAT3)
SDMMC0_DET: R108.2 ; port SDMMC0_DET
SDMMC0_DET_X: D6.1 R108.1 SD1.9(CDET)
SDMMC0_PWREN: R100.1 R101.2 ; port SDMMC0_PWREN
NetC184_1: C184.1 U10.C2(VDDI)
NetQ3_1: Q3.1 R100.2

Not connected (* = marked no-connect by the designer): U10 A1(NC_A1) A2(NC_A2) A7(NC_A7) A8(NC_A8) A9(NC_A9) A10(NC_A10) A11(NC_A11) A12(NC_A12) A13(NC_A13) A14(NC_A14) B1(NC_B1) B7(NC_B7) B8(NC_B8) B9(NC_B9) B10(NC_B10) B11(NC_B11) B12(NC_B12) B13(NC_B13) B14(NC_B14) C1(NC_C1) C3(NC_C3) C5(NC_C5) C7(NC_C7) C8(NC_C8) C9(NC_C9) C10(NC_C10) C11(NC_C11) C12(NC_C12) C13(NC_C13) C14(NC_C14) D1(NC_D1) D2(NC_D2) D3(NC_D3) D4(NC_D4) D12(NC_D12) D13(NC_D13) D14(NC_D14) E1(NC_E1) E2(NC_E2) E3(NC_E3) E5(NC_E5) E8(NC_E8) E9(VSF1) E10(VSF2) E12(NC_E12) E13(NC_E13) E14(NC_E14) F1(NC_F1) F2(NC_F2) F3(NC_F3) F10(VSF3) F12(NC_F12) F13(NC_F13) F14(NC_F14) G1(NC_G1) G2(NC_G2) G3(NC_G3) G10(NC_G10) G12(NC_G12) G13(NC_G13) G14(NC_G14) H1(NC_H1) H2(NC_H2) H3(NC_H3) H5(RCLK)* H12(NC_H12) H13(NC_H13) H14(NC_H14) J1(NC_J1) J2(NC_J2) J3(NC_J3) J12(NC_J12) J13(NC_J13) J14(NC_J14) K1(NC_K1) K2(NC_K2) K3(NC_K3) K6(NC_K6) K7(NC_K7) K10(VSF4) K12(NC_K12) K13(NC_K13) K14(NC_K14) L1(NC_L1) L2(NC_L2) L3(NC_L3) L12(NC_L12) L13(NC_L13) L14(NC_L14) M1(NC_M1) M2(NC_M2) M3(NC_M3) M7(NC_M7) M8(NC_M8) M9(NC_M9) M10(NC_M10) M11(NC_M11) M12(NC_M12) M13(NC_M13) M14(NC_M14) N1(NC_N1) N3(NC_N3) N6(NC_N6) N7(NC_N7) N8(NC_N8) N9(NC_N9) N10(NC_N10) N11(NC_N11) N12(NC_N12) N13(NC_N13) N14(NC_N14) P1(NC_P1) P2(NC_P2) P7(NC_P7) P8(NC_P8) P9(NC_P9) P10(NC_P10) P11(NC_P11) P12(NC_P12) P13(NC_P13) P14(NC_P14)

### Layout directives
net class eMMC_50: eMMC_CLK, eMMC_CLKO, eMMC_CMD, eMMC_D0, eMMC_D1, eMMC_D2, eMMC_D3, eMMC_D4, eMMC_D5, eMMC_D6, eMMC_D7
net class SDMMC0: SDMMC0_CLK, SDMMC0_CLK_X, SDMMC0_CMD, SDMMC0_CMD_X, SDMMC0_D0, SDMMC0_D0_X, SDMMC0_D1, SDMMC0_D1_X, SDMMC0_D2_JTAG_TCK, SDMMC0_D2_JTAG_TCK_X, SDMMC0_D3_JTAG_TMS, SDMMC0_D3_JTAG_TMS_X

### Notes on the sheet
- eMMC SD CARD
- (near R98) DNP
- (near Q3) DNP
- (near R100) DNP
- (near R101) DNP
- (in symbol MTFC4GMWDM-3M AIT A, part A) eMMC
- (in symbol WPM2015-3/TR) S; D; G

### Library data of the parts
C176-C186 = CAP_NP: CLASS: DISCRETE
D6-D12 = PGB1010603MR: SUPPRESSOR ESD 24VDC 0603 SMD; Manufacturer: Littelfuse Inc; Voltage - Reverse Standoff (Typ): 24V; Polarization: Bidirectional; Supplier 1: Digi-Key; Manufacturer Part Number: PGB1010603MR; RoHS: RoHS Compliant; Category: Circuit Protection; Stock 1: 155406; Pricing 1: 1=0.66, 10=0.556, 25=0.4872, 100=0.4172, 250=0.3618, 500=0.30646 (USD); Packaging: Cut Tape (CT); Voltage - Breakdown: -; Power (Watts): -; Mounting Type: Surface Mount; Package / Case: 0603 (1608 Metric); Supplier Device Package: 0603 (1608 Metric); ComponentLink1URL: http://www.littelfuse.com/data/en/Data_Sheets/Littelfuse_PulseGuard-ESD_PGB1.pdf; ComponentLink1Description: http://www.littelfuse.com/data/en/Data_Sheets/Littelfuse_PulseGuard-ESD_PGB1.pdf; Supplier Part Number 1: F2594CT-ND
Q3 = WPM2015-3/TR: WPM2015 , Single P-Channel, -20V, -2.4A, Power MOSFET , By Arman Arvand; Pakage: SOT-23(SOT-23-3); Footprint: SOT23_3; Mfr_Part_No: WPM2015-3/TR; LCSC Part #: C213159; ComponentLink1Description: LCSC Link; ComponentLink1URL: https://lcsc.com/product-detail/MOSFET_WILLSEMI-Will-Semicon-WPM2015-3-TR_C213159.html; ComponentLink2Description: DigiPart; ComponentLink2URL: https://www.digipart.com/part/WPM2015-3
R94-R108 = RES: CLASS: DISCRETE
SD1 = DM3CS-SF: CONN MICRO SD CARD HINGED TYPE; Manufacturer: Hirose Electric Co Ltd; Card Type: Secure Digital - microSD™; Connector Type: Connector; Insertion, Removal Method: Hinged Lid; Number of Positions: 10 (8 + 2); Part Number: DM3CS-SF; ComponentLink1Description: Datasheet; ComponentLink1URL: https://www.hirose.com/product/document?clcode=CL0609-0033-6-00&productname=DM3AT-SF-PEJ2M5&series=DM3&documenttype=Catalog&lang=en&documentid=D49662_en; ComponentLink2Description: DigiKey Link; ComponentLink2URL: //digikey.com/product-detail/en/hirose-electric-co-ltd/DM3CS-SF/HR1972TR-ND/2602739; Contact Finish: Gold; Features: Switch; Height Above Board: 0.072" (1.83mm); LastUpdated: 12/16/2019 8:36:12 PM; Lifecycle Status: 0; Minimum Order: 1; Mounting Feature: Normal, Standard - Top; Mounting Type: Surface Mount, Right Angle; Packaging: TapeAndReel; Part Status: Active; Price: 0.77; Series: DM3; Supplier 1: DigiKey; Supplier Part Number 1: HR1972TR-ND
U10 = MTFC4GMWDM-3M AIT A: MTFC4GMWDM-3M_AIT_A_TFBGA_153P\By Arman Arvand note!  pin A6 in eMMC V4.51 must be NC(RFU); Mfr_Part_No_1: MTFC4GLGDM-AIT A; CLASS: IC; ComponentLink1Description: Supplier; ComponentLink1URL: https://www.micron.com/products/managed-nand/emmc/part-catalog/mtfc4gmwdm-3m-ait-a?modal={89F0AB92-C039-4EF6-850D-62E989ADCE61}&did={5C81622E-64E0-46E7-8D9C-79804698EA07}; ComponentLink2Description: Mouser link; ComponentLink2URL: https://www.mouser.com/ProductDetail/Micron/MTFC4GMWDM-3M-AIT-A?qs=vLWxofP3U2wAo2cXgoPupQ%3D%3D; Mouser No 1: 340-397841-TRAY; Mfr_Part_No_2: MTFC4GMWDM-3M AIT A; Mouser No 2: 340-397035-TRAY; Mfr_Part_No_3: MTFC4GLGDM-AIT A; Mouser No 3: 340-397841-TRAY

## Sheet OSC_PLL_SARDC_OPTeFUSE.SchDoc
size A3; SheetNumber: 6; SheetTotal: 18
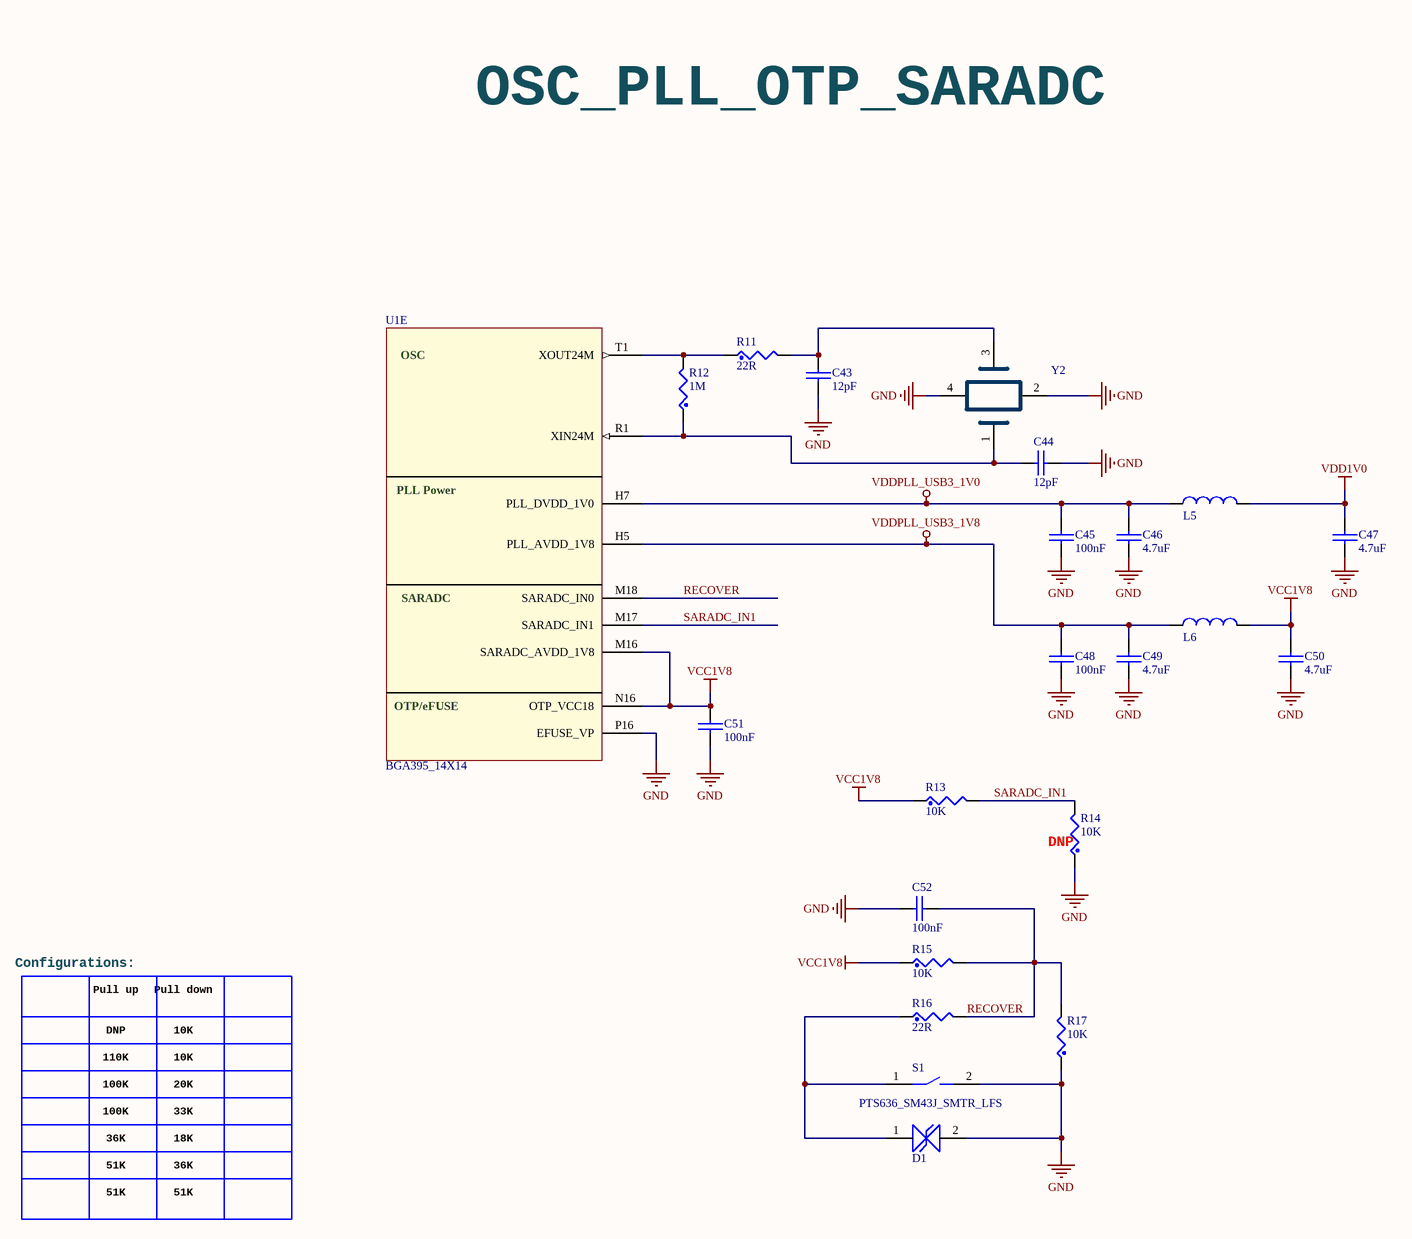
[diagram p8: OSC_PLL_SARDC_OPTeFUSE.SchDoc]

### Parts
C43  12pF  [0402_CC - C]
C44  12pF  [0402_CC - C]
C45  100nF  [0402_CC - C]
C46  4.7uF  [0402_CC - C]
C47  4.7uF  [0402_CC - C]
C48  100nF  [0402_CC - C]
C49  4.7uF  [0402_CC - C]
C50  4.7uF  [0402_CC - C]
C51  100nF  [0402_CC - C]
C52  100nF  [0402_CC - C]
D1  TVS  [SODFL100X45-2N]  (value not drawn)
L5  INDCHIP  [0603_C_Inductor]  (value not drawn)
L6  INDCHIP  [0603_C_Inductor]  (value not drawn)
R11  22R  [0402_CR]
R12  1M  [0402_CR]
R13  10K  [0402_CR]
R14  10K  [0402_CR]
R15  10K  [0402_CR]
R16  22R  [0402_CR]
R17  10K  [0402_CR]
S1  PTS636_SM43J_SMTR_LFS  [PTS636_3.5_6_4.3]
U1  BGA395_14X14  [BGA395C65P21X21_1750X1750X117]  (part E of 17)
Y2  7R-24.000MEEC-T  [7R24000MEECT]  (value not drawn)

### Nets
GND: C43.1 C44.1 C45.2 C46.2 C47.2 C48.2 C49.2 C50.2 C51.2 C52.1 D1.2 R14.1 R17.1 S1.2 U1.P16(EFUSE_VP) Y2.2(NC_1) Y2.4(NC_2)
VCC1V8: C50.1 C51.1 L6.2 R13.1 R15.1 U1.M16(SARADC_AVDD_1V8) U1.N16(OTP_VCC18)
VDD1V0: C47.1 L5.2
VDDPLL_USB3_1V0: C45.1 C46.1 L5.1 U1.H7(PLL_DVDD_1V0)
VDDPLL_USB3_1V8: C48.1 C49.1 L6.1 U1.H5(PLL_AVDD_1V8)
RECOVER: C52.2 R15.2 R16.2 R17.2 U1.M18(SARADC_IN0)
SARADC_IN1: R13.2 R14.2 U1.M17(SARADC_IN1)
NetC43_2: C43.2 R11.2 Y2.3(X1_2)
NetC44_2: C44.2 R12.1 U1.R1(XIN24M) Y2.1(X1_1)
NetD1_1: D1.1 R16.1 S1.1
NetR11_1: R11.1 R12.2 U1.T1(XOUT24M)

### Notes on the sheet
- OSC_PLL_OTP_SARADC
- (near R14) DNP
- Configurations:
- Pull up
- Pull down
- DNP
- 110K
- 100K
- 10K
- 20K
- 36K
- 33K
- 18K
- 51K
- (in symbol RK3328, part E) OSC; PLL Power; SARADC; OTP/eFUSE

### Library data of the parts
C43-C52 = CAP_NP: CLASS: DISCRETE
D1 = ESD5451N: AZ5825-01F, Bi-directional TVS, Working Voltage = 5V, Transient protection IEC61000-4-2 : +-30KV,  By AAR; Mfr_Part_No: ESD5451N-2/TR; ComponentLink1Description: Supplier; ComponentLink1URL: https://lcsc.com/product-detail/TVS_Will-Semicon-ESD5451N-2-TR_C239604.html; LCSC Part #: C239604; Package/Case: =Footprint
L5 L6 = INDCHIP: Fixed Inductors  TDK, By AAR
R11-R17 = RES: CLASS: DISCRETE
S1 = PTS636: Tactile Switches Tact 50mA 12VDC, 6.0x3.5, 4.3mm H, 180gf, J leads, No ground pin, Black Actuator; Mfr_Part_No: PTS636 SM43J SMTR LFS; Mouser No: 611-PTS636SM43JSMTRL
U1 = RK3328: By AAR
Y2 = 7R-24.000MEEC-T: AAR, Crystal or Oscillator; Mfr: TXC; Datasheet Link: https://www.mouser.com/datasheet/2/417/7r-1771103.pdf; Height: 0.6mm; Mfr_Part_No: 7R-24.000MEEC-T; Mouser No: 717-7R-24.000MEEC-T